# EAGLE design misko_nucleo (EAGLE 9.6.2)
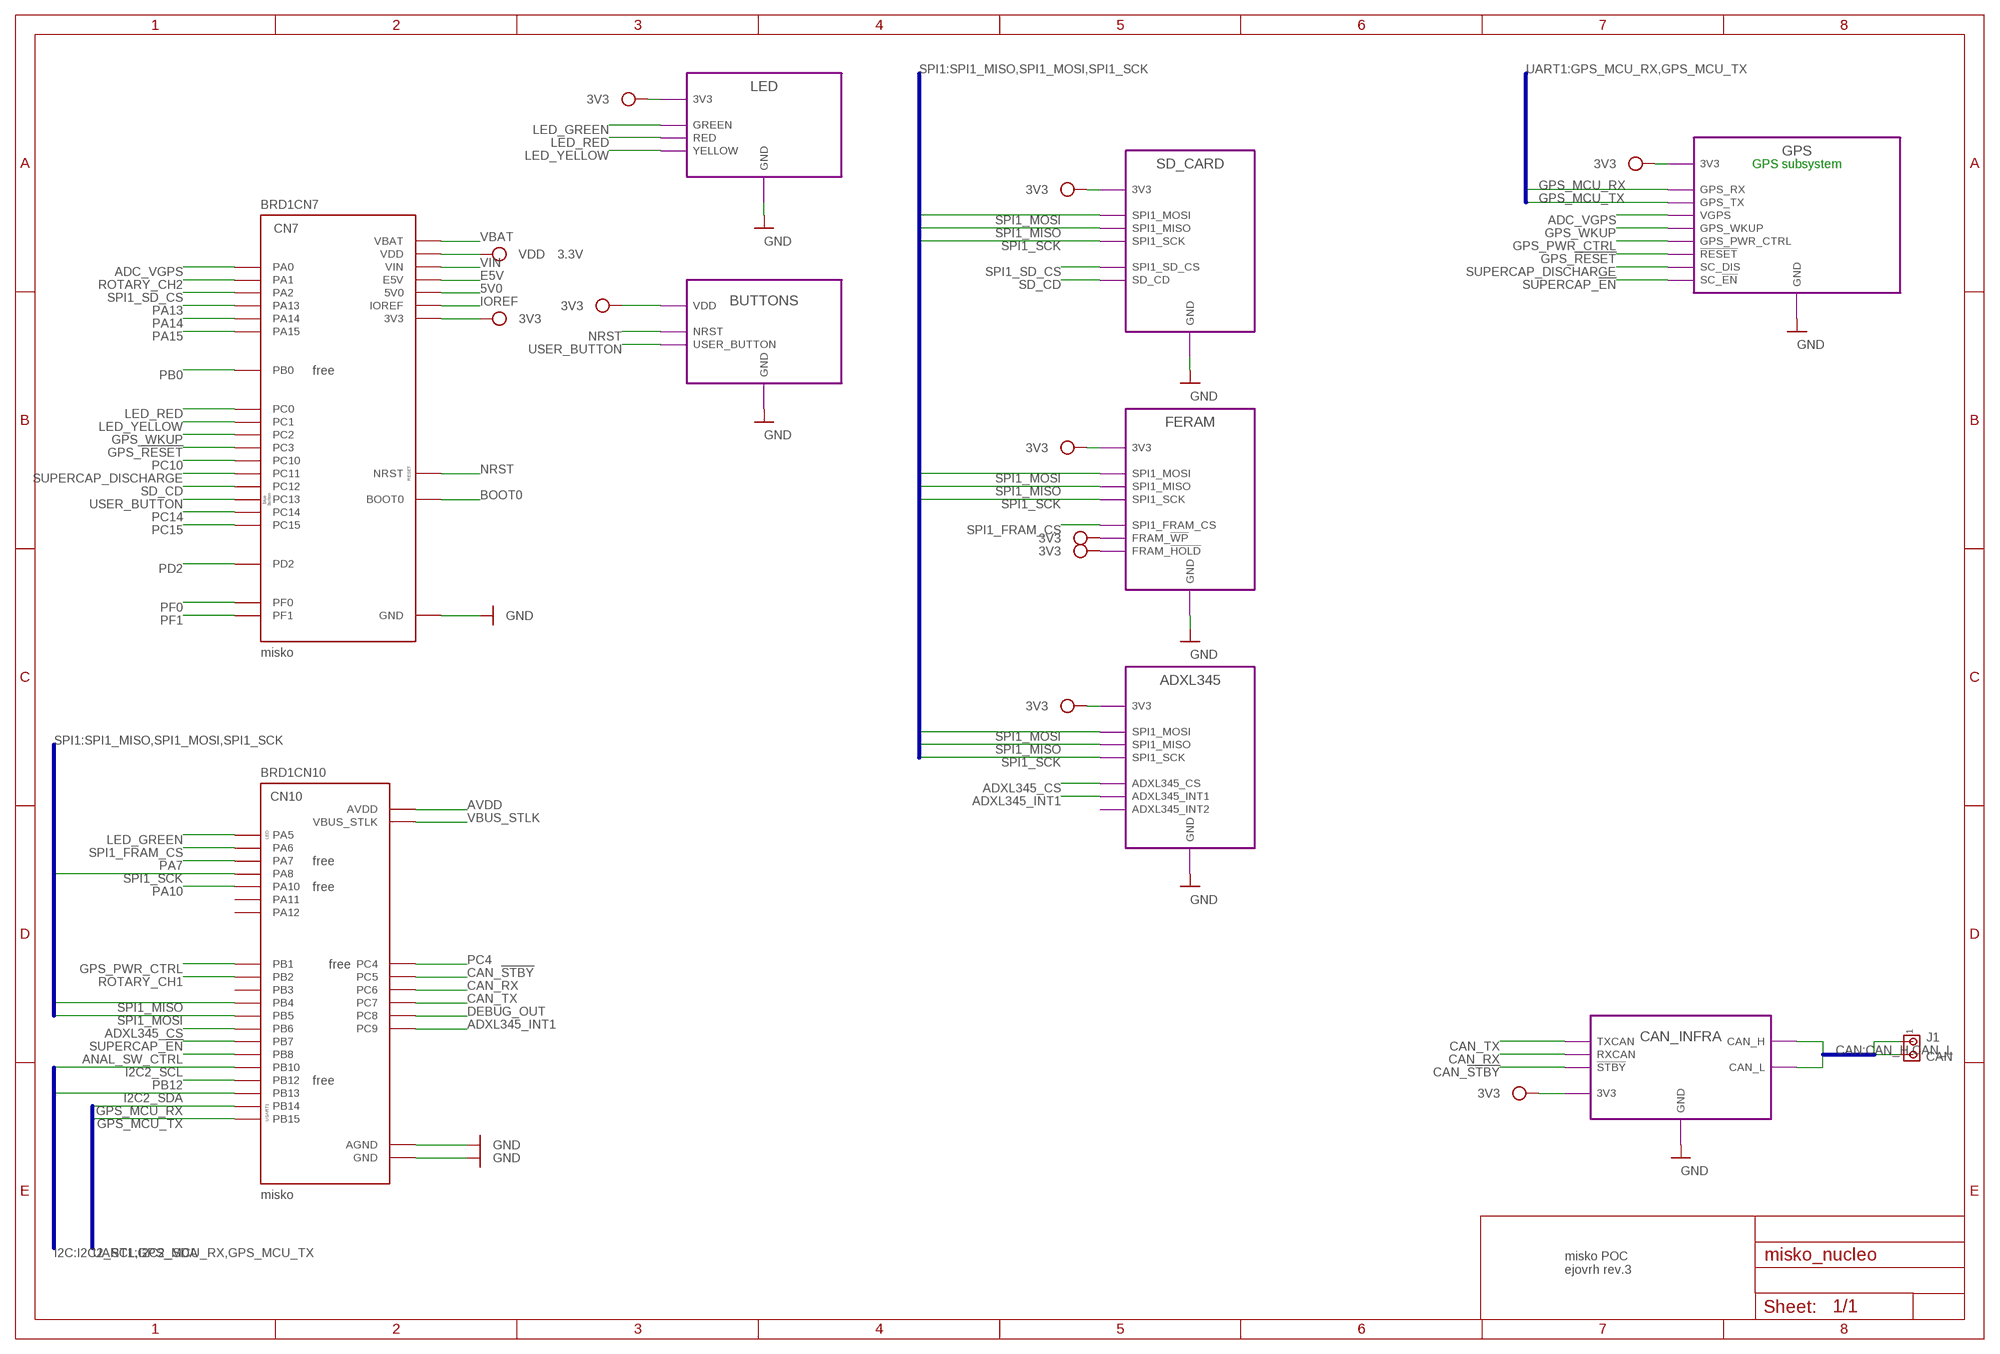
[diagram p0: schematic, sheet 1]

## Parts
BRD1  misko  NUCLEO-H503RB-B02  [NUCLEO-H503RB-B02]
J1  CAN  MTA02-100  [10X02MTA]

## Module instances
ADXL345 = ADXL345 (part numbers offset by 1300)
FERAM = FERAM (part numbers offset by 1200)
SD_CARD = SD_CARD (part numbers offset by 1100)
GPS = GPS_SUBSYSTEM (part numbers offset by 1500)
LED = LED (part numbers offset by 1700)
CAN_INFRA = CAN_INFRA (part numbers offset by 400)
BUTTONS = BUTTONS (part numbers offset by 1400)

## Nets
3V3 [3V3]: BRD1.CN7_16(CN7:3V3) ; port ADXL345.3V3 FERAM.3V3 FERAM.FRAM_!WP! FERAM.FRAM_!HOLD! SD_CARD.3V3 GPS.3V3 LED.3V3 CAN_INFRA.3V3 BUTTONS.VDD
5V0 [5V0]: BRD1.CN7_18(CN7:5V0)
ADC_VGPS [3V3]: BRD1.CN7_28(CN7:PA0) ; port GPS.VGPS
ADXL345_CS [signal]: BRD1.CN10_3(CN10:PB6) ; port ADXL345.ADXL345_CS
ADXL345_INT1 [signal]: BRD1.CN10_17(CN10:PC9) ; port ADXL345.ADXL345_INT1
ANAL_SW_CTRL [signal]: BRD1.CN10_36(CN10:PB8)
AVDD [signal]: BRD1.CN10_7(CN10:AVDD)
BOOT0 [signal]: BRD1.CN7_7(CN7:BOOT0)
CAN_!STBY! [signal]: BRD1.CN10_6(CN10:PC5) ; port CAN_INFRA.!STBY!
CAN_H [signal]: J1.1 ; port CAN_INFRA.CAN_H
CAN_L [signal]: J1.2 ; port CAN_INFRA.CAN_L
CAN_RX [signal]: BRD1.CN10_19(CN10:PC6) ; port CAN_INFRA.RXCAN
CAN_TX [signal]: BRD1.CN10_21(CN10:PC7) ; port CAN_INFRA.TXCAN
DEBUG_OUT [signal]: BRD1.CN10_2(CN10:PC8)
E5V [5V0]: BRD1.CN7_6(CN7:E5V)
GND: BRD1.CN7_8(CN7:GND) BRD1.CN7_19(CN7:GND) BRD1.CN7_20(CN7:GND) BRD1.CN7_22(CN7:GND) BRD1.CN10_9(CN10:GND) BRD1.CN10_20(CN10:GND) BRD1.CN10_32(CN10:AGND) ; port ADXL345.GND FERAM.GND SD_CARD.GND GPS.GND LED.GND CAN_INFRA.GND BUTTONS.GND
GPS_!RESET! [signal]: BRD1.CN7_37(CN7:PC3) ; port GPS.!RESET!
GPS_MCU_RX [signal]: BRD1.CN10_28(CN10:PB14) BRD1.CN10_35(CN10:PB14) ; port GPS.GPS_RX
GPS_MCU_TX [signal]: BRD1.CN10_26(CN10:PB15) BRD1.CN10_37(CN10:PB15) ; port GPS.GPS_TX
GPS_PWR_CTRL [signal]: BRD1.CN10_24(CN10:PB1) ; port GPS.GPS_PWR_CTRL
GPS_WKUP [signal]: BRD1.CN7_35(CN7:PC2) ; port GPS.GPS_WKUP
I2C2_SCL [signal]: BRD1.CN10_25(CN10:PB10)
I2C2_SDA [signal]: BRD1.CN10_30(CN10:PB13)
IOREF [signal]: BRD1.CN7_12(CN7:IOREF)
LED_GREEN [signal]: BRD1.CN10_11(CN10:PA5) ; port LED.GREEN
LED_RED [signal]: BRD1.CN7_38(CN7:PC0) ; port LED.RED
LED_YELLOW [signal]: BRD1.CN7_36(CN7:PC1) ; port LED.YELLOW
NRST [signal]: BRD1.CN7_14(CN7:NRST) ; port BUTTONS.NRST
PA7 [signal]: BRD1.CN10_15(CN10:PA7)
PA10 [signal]: BRD1.CN10_33(CN10:PA10)
PA13 [signal]: BRD1.CN7_13(CN7:PA13)
PA14 [signal]: BRD1.CN7_15(CN7:PA14)
PA15 [signal]: BRD1.CN7_17(CN7:PA15)
PB0 [signal]: BRD1.CN7_34(CN7:PB0)
PB12 [signal]: BRD1.CN10_16(CN10:PB12)
PC4 [signal]: BRD1.CN10_34(CN10:PC4)
PC10 [signal]: BRD1.CN7_1(CN7:PC10)
PC14 [signal]: BRD1.CN7_25(CN7:PC14)
PC15 [signal]: BRD1.CN7_27(CN7:PC15)
PD2 [signal]: BRD1.CN7_4(CN7:PD2)
PF0 [signal]: BRD1.CN7_29(CN7:PF0)
PF1 [signal]: BRD1.CN7_31(CN7:PF1)
ROTARY_CH1 [signal]: BRD1.CN10_22(CN10:PB2)
ROTARY_CH2 [signal]: BRD1.CN7_30(CN7:PA1)
SD_CD [signal]: BRD1.CN7_3(CN7:PC12) ; port SD_CARD.SD_CD
SPI1_FRAM_CS [signal]: BRD1.CN10_13(CN10:PA6) ; port FERAM.SPI1_FRAM_CS
SPI1_MISO [signal]: BRD1.CN10_27(CN10:PB4) ; port ADXL345.SPI1_MISO FERAM.SPI1_MISO SD_CARD.SPI1_MISO
SPI1_MOSI [signal]: BRD1.CN10_29(CN10:PB5) ; port ADXL345.SPI1_MOSI FERAM.SPI1_MOSI SD_CARD.SPI1_MOSI
SPI1_SCK [signal]: BRD1.CN10_23(CN10:PA8) ; port ADXL345.SPI1_SCK FERAM.SPI1_SCK SD_CARD.SPI1_SCK
SPI1_SD_CS [signal]: BRD1.CN7_32(CN7:PA2) ; port SD_CARD.SPI1_SD_CS
SUPERCAP_!EN! [signal]: BRD1.CN10_5(CN10:PB7) ; port GPS.SC_!EN!
SUPERCAP_DISCHARGE [signal]: BRD1.CN7_2(CN7:PC11) ; port GPS.SC_DIS
USER_BUTTON [signal]: BRD1.CN7_23(CN7:PC13) ; port BUTTONS.USER_BUTTON
VBAT [signal]: BRD1.CN7_33(CN7:VBAT)
VBUS_STLK [signal]: BRD1.CN10_8(CN10:VBUS_STLK)
VDD [3V3]: BRD1.CN7_5(CN7:VDD)
VIN [5V0]: BRD1.CN7_24(CN7:VIN)
Unconnected: BRD1.CN10_12(CN10:PA12) BRD1.CN10_14(CN10:PA11) BRD1.CN10_31(CN10:PB3)

## Buses
SPI1:SPI1_MISO,SPI1_MOSI,SPI1_SCK
UART1:GPS_MCU_RX,GPS_MCU_TX
I2C:I2C2_SCL,I2C2_SDA
CAN:CAN_H,CAN_L

## Notes on the sheet
- GPS subsystem
- 3.3V
- free
- free
- free
- free
- free
- misko POC
  ejovrh rev.3

## Library data of the parts
BRD1 = NUCLEO-H503RB-B02:NUCLEO-H503RB-B02: Check availability <https://pricing.snapeda.com/parts/NUCLEO-F303RE/STMicroelectronics/view-part?ref=eda>; AVAILABILITY: In Stock; CHECK_PRICES: https://www.snapeda.com/parts/NUCLEO-F303RE/STMicroelectronics/view-part/?ref=eda; DESCRIPTION: STM32F303RE, mbed-Enabled Development Nucleo-64 STM32F3 ARM® Cortex®-M4 MCU 32-Bit Embedded Evaluation Board; MF: STMicroelectronics; MP: NUCLEO-F303RE; PACKAGE: None; PRICE: None; PURCHASE-URL: https://www.snapeda.com/api/url_track_click_mouser/?unipart_id=246753&manufacturer=STMicroelectronics&part_name=NUCLEO-F303RE&search_term=nucleo-h; SNAPEDA_LINK: https://www.snapeda.com/parts/NUCLEO-F303RE/STMicroelectronics/view-part/?ref=snap
J1 = con-amp:MTA02-100: AMP connector

## Module ADXL345
Ports: GND(pwr) 3V3(pwr) ADXL345_INT1(out) ADXL345_CS(in) SPI1_MOSI(in) SPI1_MISO(out) SPI1_SCK(in) ADXL345_INT2(out)
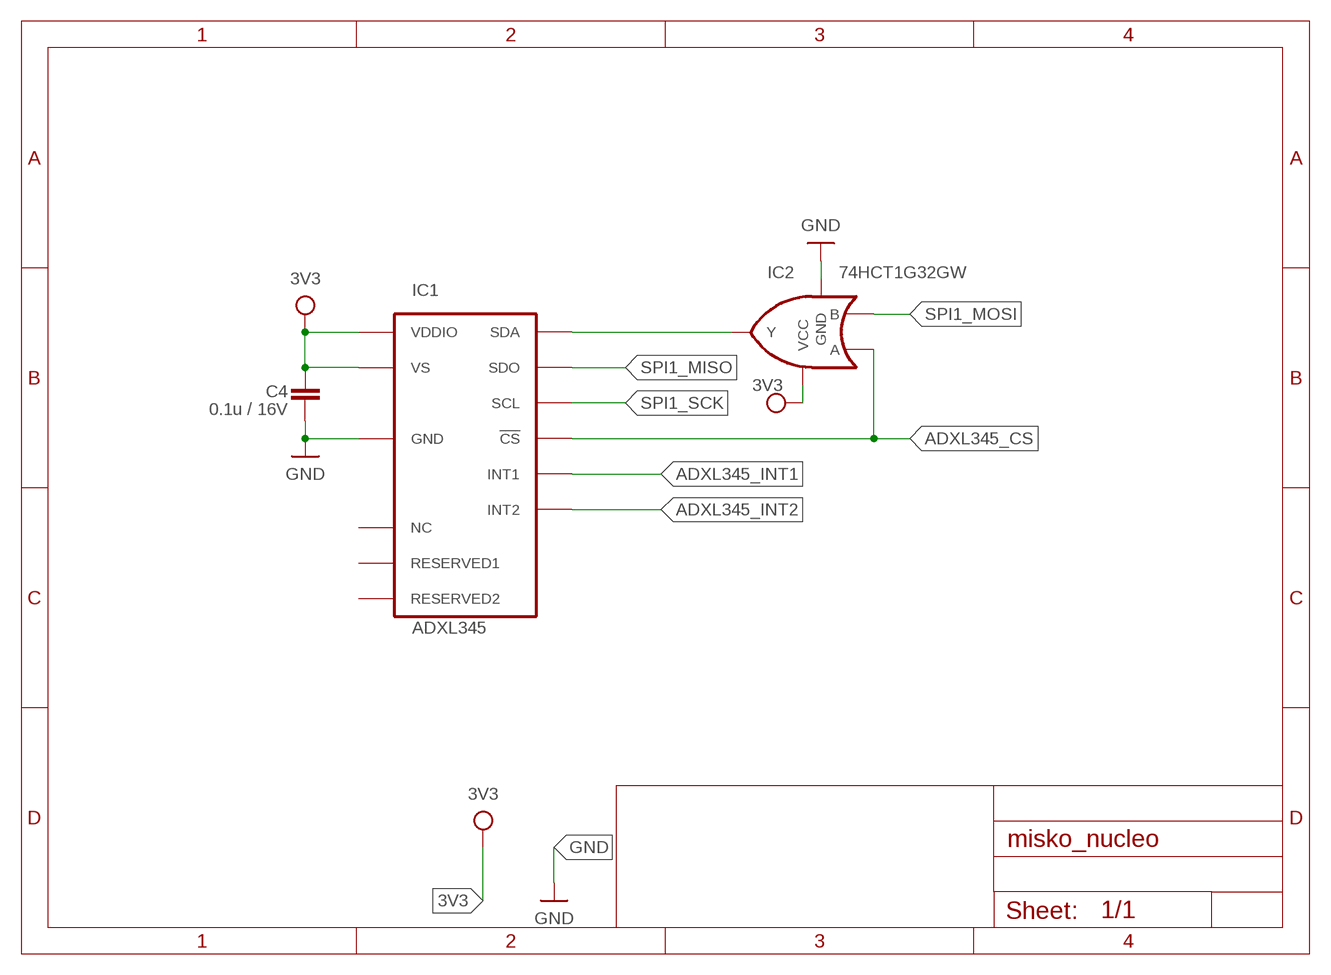
[diagram p1: schematic, module ADXL345, sheet 1]

### Parts
C4  0.1u / 16V  C-EUC0402  [C0402]
IC1  ADXL345  [LGA14]
IC2  74HCT1G32GW  74HCT1G32GW-DC  [SOT353/5]

### Nets
3V3: C4.1 IC1.VCC(VS) IC1.VDD(VDDIO) IC2.VCC
ADXL345_CS [signal]: IC1.!CS! IC2.A
ADXL345_INT1 [signal]: IC1.INT1
ADXL345_INT2: IC1.INT2
ADXL345SDA [signal]: IC1.SDA IC2.Y
GND: C4.2 IC1.GND1(GND) IC1.GND2(GND) IC1.GND3(GND) IC2.GND
SPI1_MISO [signal]: IC1.SDO
SPI1_MOSI [signal]: IC2.B
SPI1_SCK [signal]: IC1.SCL
Unconnected: IC1.NC IC1.RESERVED1 IC1.RESERVED2

### Library data of the parts
C4 = rcl:C-EU: CAPACITOR, European symbol
IC1 = ADXL345 Accelerometer:ADXL345: 3-Axis, ±2 g/±4 g/±8 g/±16 g Digital Accelerometer
IC2 = 74HCT1G32GW - OR Gate:74HCT1G32GW: Two Input OR gate

## Module FERAM
Ports: GND(pwr) 3V3(pwr) SPI1_MOSI(in) SPI1_MISO(out) SPI1_SCK(in) SPI1_FRAM_CS(in) FRAM_!WP!(in) FRAM_!HOLD!(in)
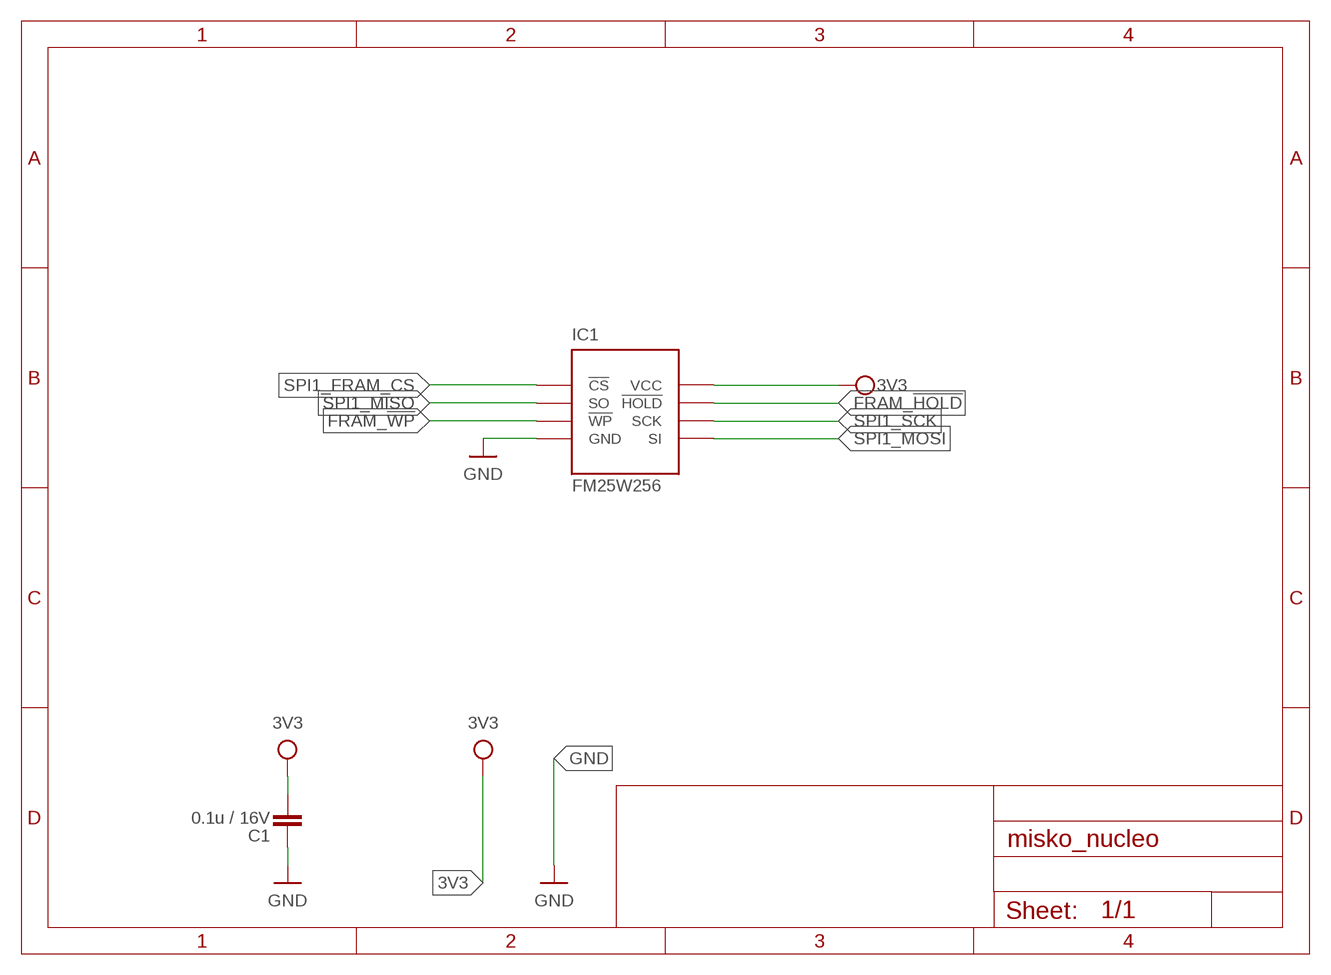
[diagram p2: schematic, module FERAM, sheet 1]

### Parts
C1  0.1u / 16V  C-EUC0402  [C0402]
IC1  FM25W256  FM25W256-SOIC  [SOIC08]

### Nets
3V3: C1.1 IC1.VCC
FRAM_!HOLD!: IC1.!HOLD!
FRAM_!WP!: IC1.!WP!
GND: C1.2 IC1.GND
SPI1_FRAM_CS [signal]: IC1.!CS!
SPI1_MISO [signal]: IC1.SO
SPI1_MOSI [signal]: IC1.SI
SPI1_SCK [signal]: IC1.SCK

### Library data of the parts
C1 = rcl:C-EU: CAPACITOR, European symbol
IC1 = FM25W256 FERAM:FM25W256: FeRAM Module; OC_FARNELL: unknown; OC_NEWARK: unknown

## Module SD_CARD
Ports: GND(pwr) 3V3(pwr) SPI1_MOSI(in) SPI1_MISO(out) SPI1_SCK(in) SPI1_SD_CS(in) SD_CD(hiz)
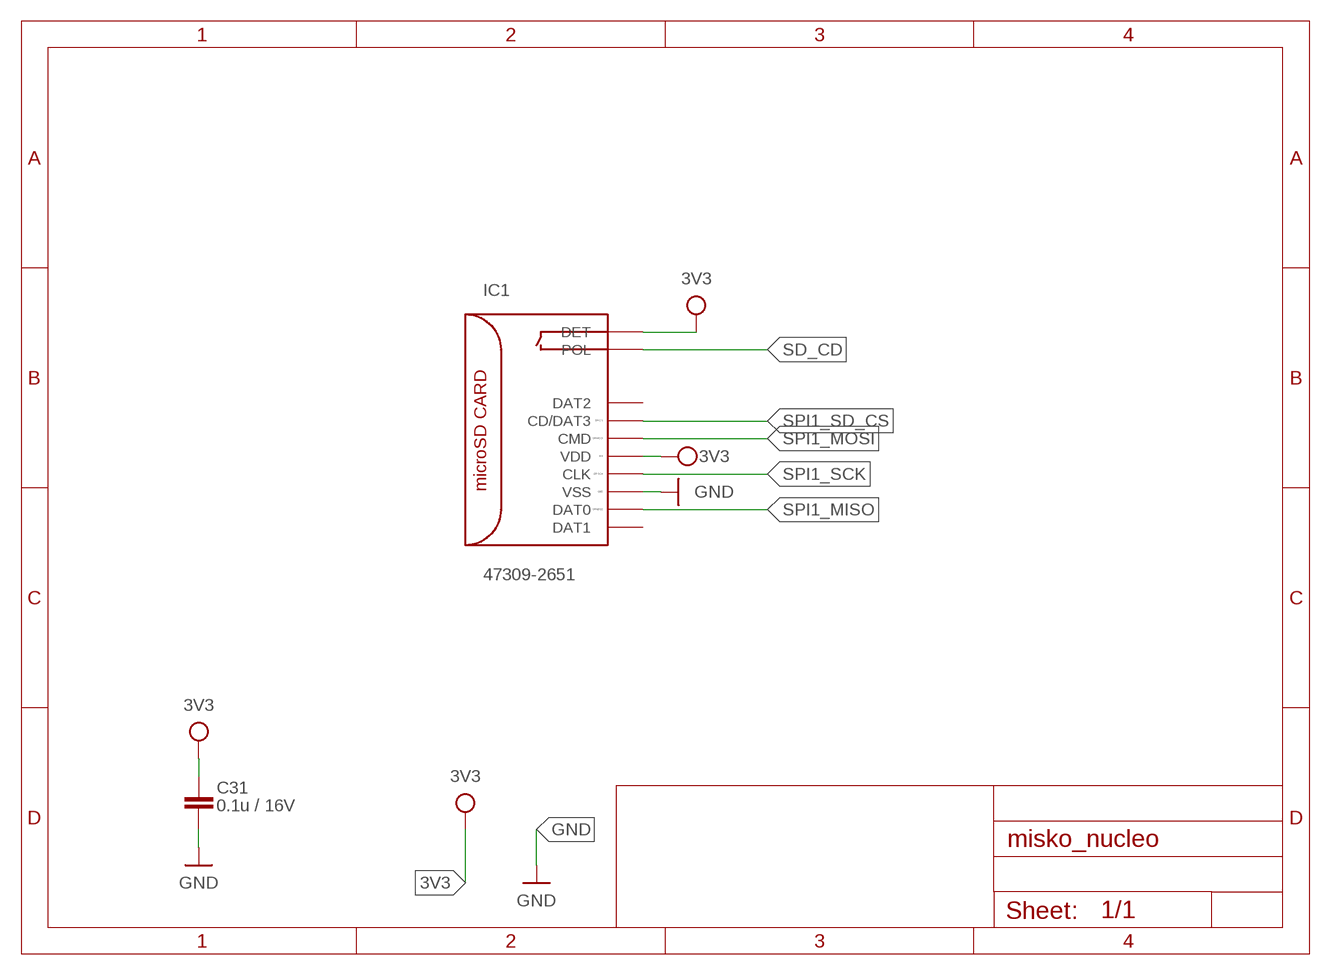
[diagram p3: schematic, module SD_CARD, sheet 1]

### Parts
C31  0.1u / 16V  C-EUC0402  [C0402]
IC1  47309-2651  MICROSD_SPI_MODE  [MICRO_SD_CONNECTOR]

### Nets
3V3: C31.1 IC1.DET IC1.VDD
GND: C31.2 IC1.GND1(VSS) IC1.GND2(VSS) IC1.GND3(VSS)
SD_CD: IC1.POL
SPI1_MISO: IC1.DAT0
SPI1_MOSI: IC1.CMD
SPI1_SCK: IC1.CLK
SPI1_SD_CS: IC1.CD/DAT3
Unconnected: IC1.DAT1 IC1.DAT2

### Library data of the parts
C31 = rcl:C-EU: CAPACITOR, European symbol
IC1 = Molex SD-47309 SD Card Slot:MICROSD_SPI_MODE: MOLEX - 49225-0821 - CONNECTEUR MICRO SD PUSH/PUSH REV Fabricant: MOLEX Code commande Farnell: 1366700 <http://fr.farnell.com/molex/49225-0821/connecteur-micro-sd-push-push-rev/dp/1366700?Ntt=1366700> Référence fabricant: 49225-0821

## Module ORG1510
Ports: GND(pwr) VGPS(pwr) RX(in) TX(out) WAKEUP(out) FORCE-ON(in) !RESET!(in)
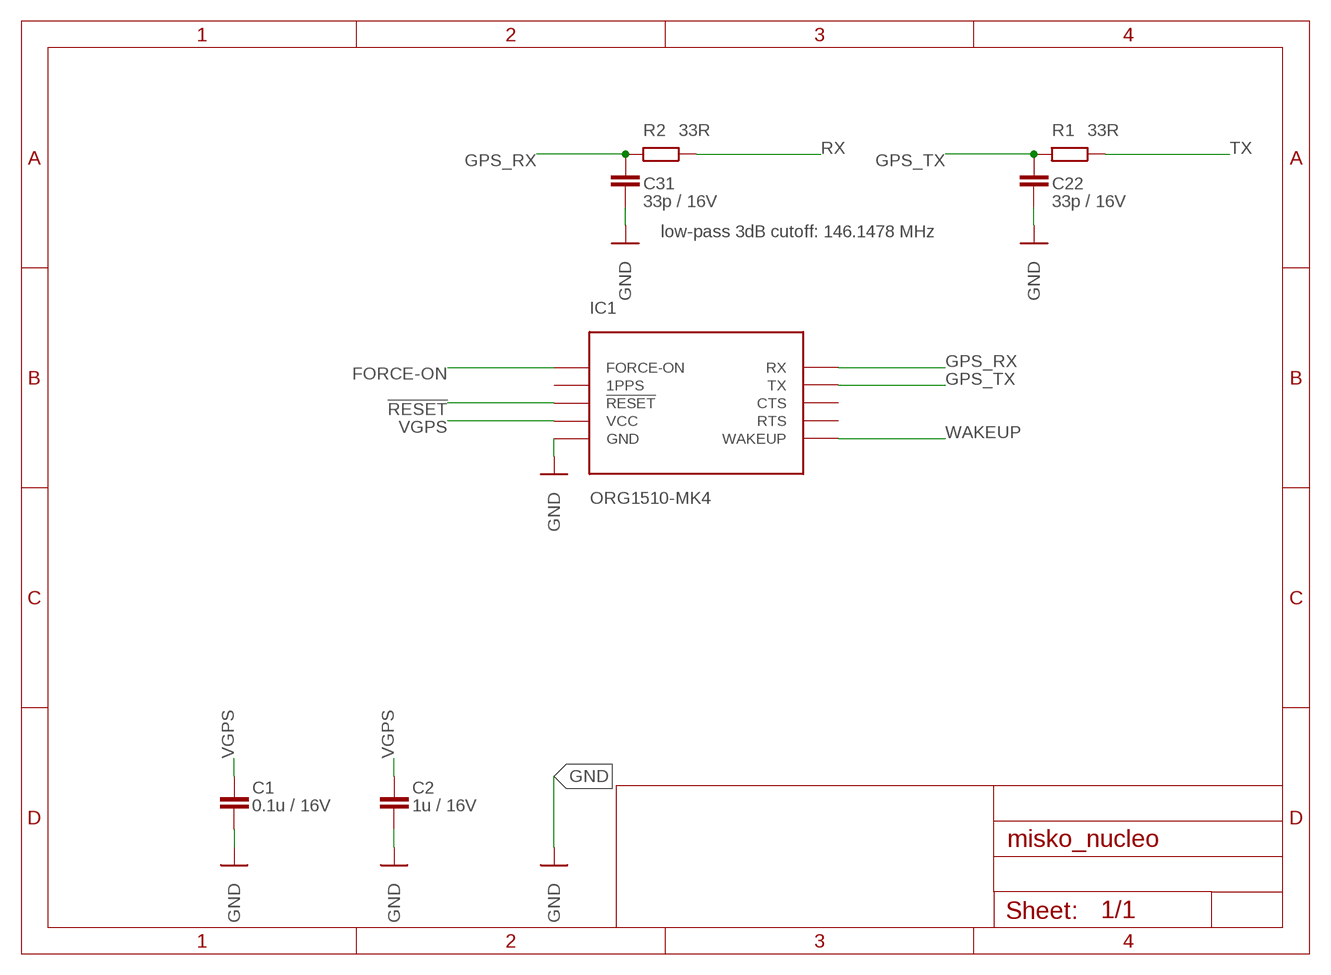
[diagram p4: schematic, module ORG1510, sheet 1]

### Parts
C1  0.1u / 16V  C-EUC0402  [C0402]
C2  1u / 16V  C-EUC0402  [C0402]
C22  33p / 16V  C-EUC0402  [C0402]
C31  33p / 16V  C-EUC0402  [C0402]
IC1  ORG1510-MK4  [SMD]
R1  33R  R-EU_R0402  [R0402]
R2  33R  R-EU_R0402  [R0402]

### Nets
!RESET! [signal]: IC1.!RESET!_8(!RESET!)
FORCE-ON [signal]: IC1.1_ON_OFF(FORCE-ON)
GND: C1.2 C2.2 C22.2 C31.2 IC1.5_GND(GND) IC1.GND1(GND) IC1.GND2(GND) IC1.GND4(GND) IC1.GND5(GND) IC1.GND6(GND) IC1.GND7(GND) IC1.GND8(GND) IC1.GND9(GND) IC1.GND10(GND) IC1.GND12(GND) IC1.GND13(GND) IC1.GND14(GND) IC1.GND15(GND)
GPS_RX [signal]: C31.1 IC1.RX_10(RX) R2.2
GPS_TX [signal]: C22.1 IC1.3_TX(TX) R1.2
RX [signal]: R2.1
TX [signal]: R1.1
VGPS [3V3]: C1.1 C2.1 IC1.4_VCC(VCC)
WAKEUP [signal]: IC1.WAKEUP_6(WAKEUP)
Unconnected: IC1.2_1PPS(1PPS) IC1.CTS_7(RTS) IC1.RTS_9(CTS)

### Notes on the sheet
- low-pass 3dB cutoff: 146.1478 MHz

### Library data of the parts
C1 C2 = resistor:C-EU: CAPACITOR, European symbol
C22 C31 = rcl:C-EU: CAPACITOR, European symbol
IC1 = ORG1510-MK4 GPS module:ORG1510-MK4
R1 R2 = rcl:R-EU_: RESISTOR, European symbol; SPICEPREFIX: R

## Module VOLTAGE_SUPERVISOR
Ports: GND(pwr) 3V3(pwr) !RESET!(out) !MR!(in) SENSE(hiz)
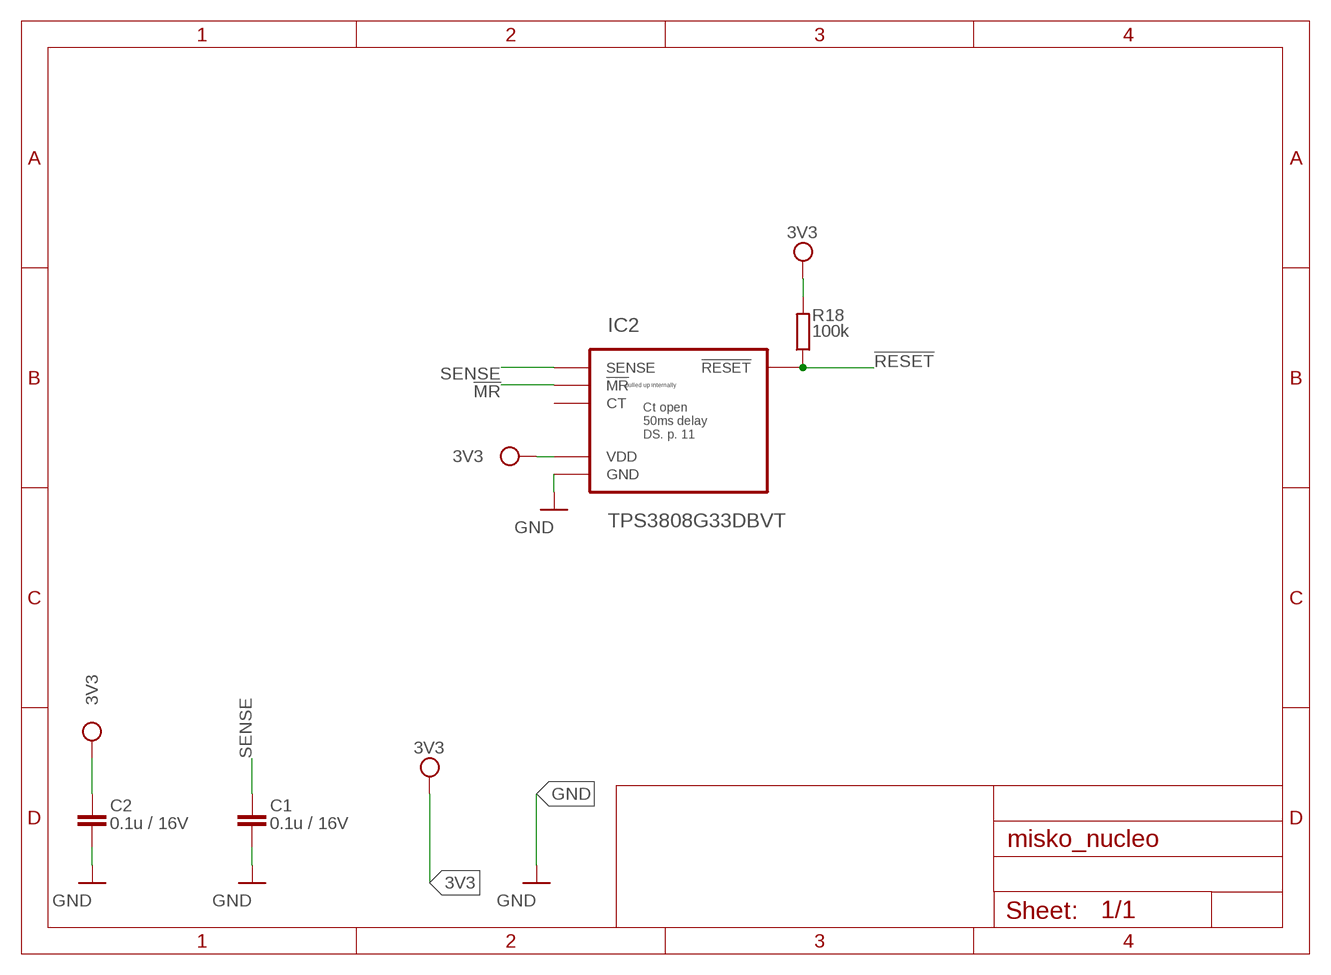
[diagram p5: schematic, module VOLTAGE_SUPERVISOR, sheet 1]

### Parts
C1  0.1u / 16V  C-EUC0402  [C0402]
C2  0.1u / 16V  C-EUC0402  [C0402]
IC2  TPS3808G33DBVT  TPS3808WSON6  [WSON-6]
R18  100k  R-EU_R0402  [R0402]

### Nets
3V3 [3V3]: C2.1 IC2.VDD R18.2
!MR! [signal]: IC2.!MR!
!RESET! [signal]: IC2.!RESET! R18.1
GND: C1.2 C2.2 IC2.GND1(GND) IC2.GND2(GND)
SENSE [3V3]: C1.1 IC2.SENSE
Unconnected: IC2.CT

### Notes on the sheet
- Ct open
  50ms delay
  DS. p. 11

### Library data of the parts
C1 C2 = rcl:C-EU: CAPACITOR, European symbol
IC2 = TPS3808 - Supervisory Circuit:TPS3808: Low Quiescent Current, Programmable-Delay Supervisory Circuit
R18 = resistor:R-EU_: RESISTOR, European symbol

## Module SUPERCAP+CHARGER
Ports: GND(pwr) 3V3(pwr) VOUT(pwr) !EN!(in) SC_DIS(in)
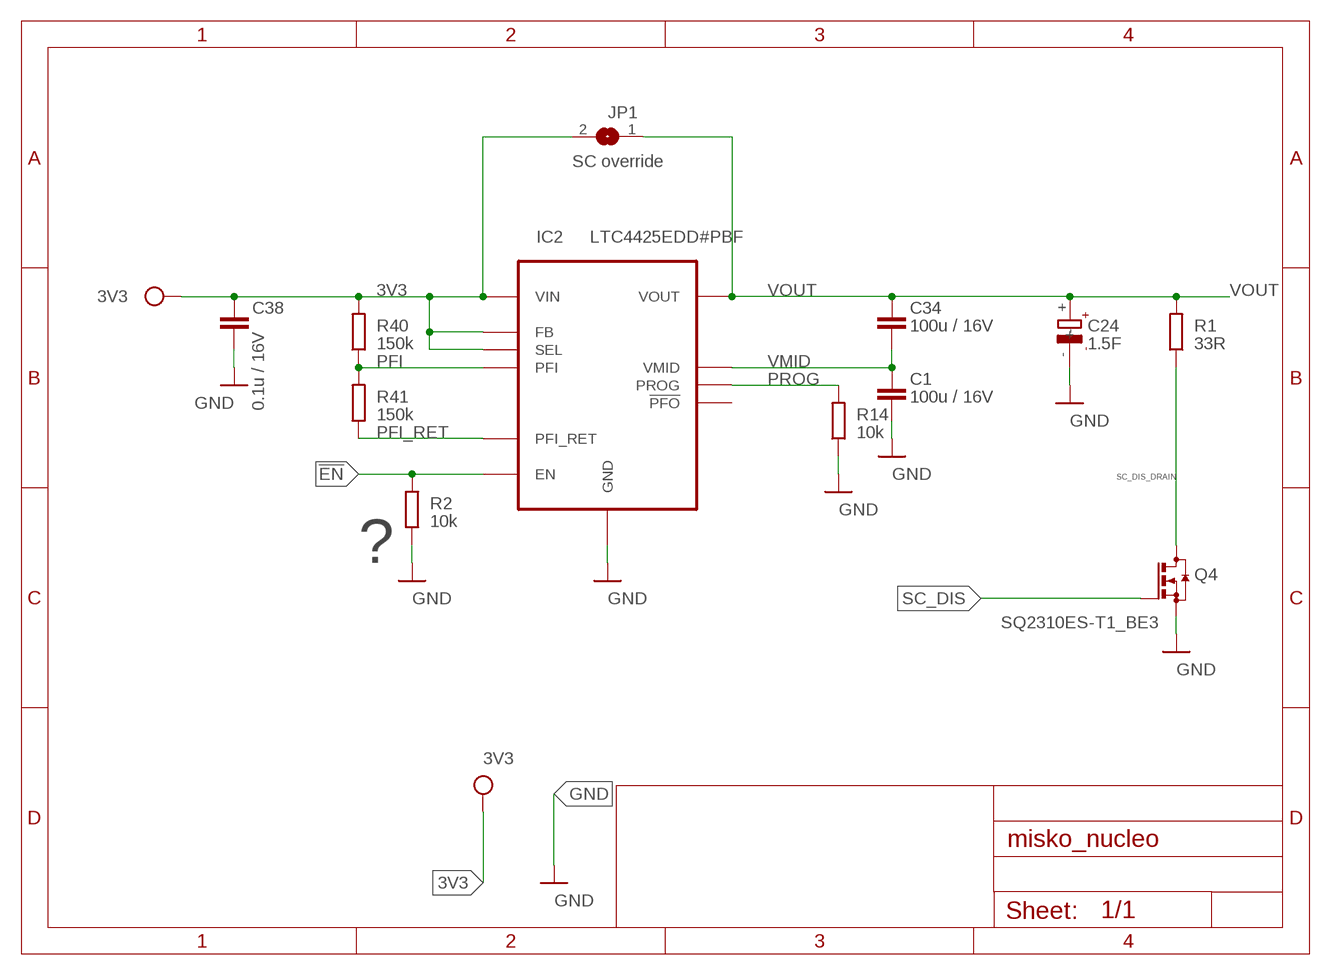
[diagram p6: schematic, module SUPERCAP+CHARGER, sheet 1]

### Parts
C1  100u / 16V  C-EUC1210  [C1210]
C24  1.5F  EECS5R5H155  [TH]
C34  100u / 16V  C-EUC1210  [C1210]
C38  0.1u / 16V  C-EUC0402  [C0402]
IC2  LTC4425EDD#PBF  LTC4425DFN-12  [DFN-12]
JP1  SC override  SJW  [SJW]
Q4  SQ2310ES-T1_BE3  BSS123  [SOT23]
R1  33R  R-EU_R1206  [R1206]
R2  10k  R-EU_R0402  [R0402]
R14  10k  R-EU_R0402  [R0402]
R40  150k  R-EU_R0402  [R0402]
R41  150k  R-EU_R0402  [R0402]

### Nets
3V3 [3V3]: C38.1 IC2.FB IC2.SEL IC2.VIN1(VIN) IC2.VIN2(VIN) JP1.2 R40.2
!EN! [signal]: IC2.EN R2.2
GND: C1.2 C24.- C38.2 IC2.GND Q4.2(S) R2.1 R14.1
PFI [signal]: IC2.PFI R40.1 R41.2
PFI_RET [signal]: IC2.PFI_RET R41.1
PROG [signal]: IC2.PROG R14.2
SC_DIS [signal]: Q4.1(G)
SC_DIS_DRAIN [signal]: Q4.3(D) R1.1
VMID [signal]: C1.1 C34.2 IC2.VMID
VOUT [3V3]: C24.+ C34.1 IC2.VOUT1(VOUT) IC2.VOUT2(VOUT) JP1.1 R1.2
Unconnected: IC2.!PFO!

### Notes on the sheet
- ?

### Library data of the parts
C1 C34 C38 = rcl:C-EU: CAPACITOR, European symbol
C24 = EECS5R5H155 Supercap:EECS5R5H155
IC2 = LTC4425 Supercap Charger:LTC4425: The ISL85003 and ISL85003A are synchronous buck regulators with integrated high-side and low-side FET’s. The regulator can operate from an input voltage range of 4.5V to 18V while delivering a very efficient continuous 3A current. This is all delivered in a very compact 3x4mm DFN package. More about it you can find at ISL85003 <http://www.intersil.com/en/products/power-management/switching-regulators/integrated-fet-regulators/ISL85003.html> The library has been designed by Richard Magdycz <https://www.facebook.com/groups/eaglecadsoftUK>
JP1 = jumper:SJ: SMD solder JUMPER
Q4 = transistor-small-signal:BSS123: N-CHANNEL MOS FET
R1 R2 R14 R40 R41 = resistor:R-EU_: RESISTOR, European symbol

## Module GPS_SUBSYSTEM
Ports: GND(pwr) 3V3(pwr) GPS_TX(out) GPS_RX(in) GPS_WKUP(out) GPS_PWR_CTRL(in) !RESET!(in) SC_!EN!(in) SC_DIS(in) VGPS(pwr)
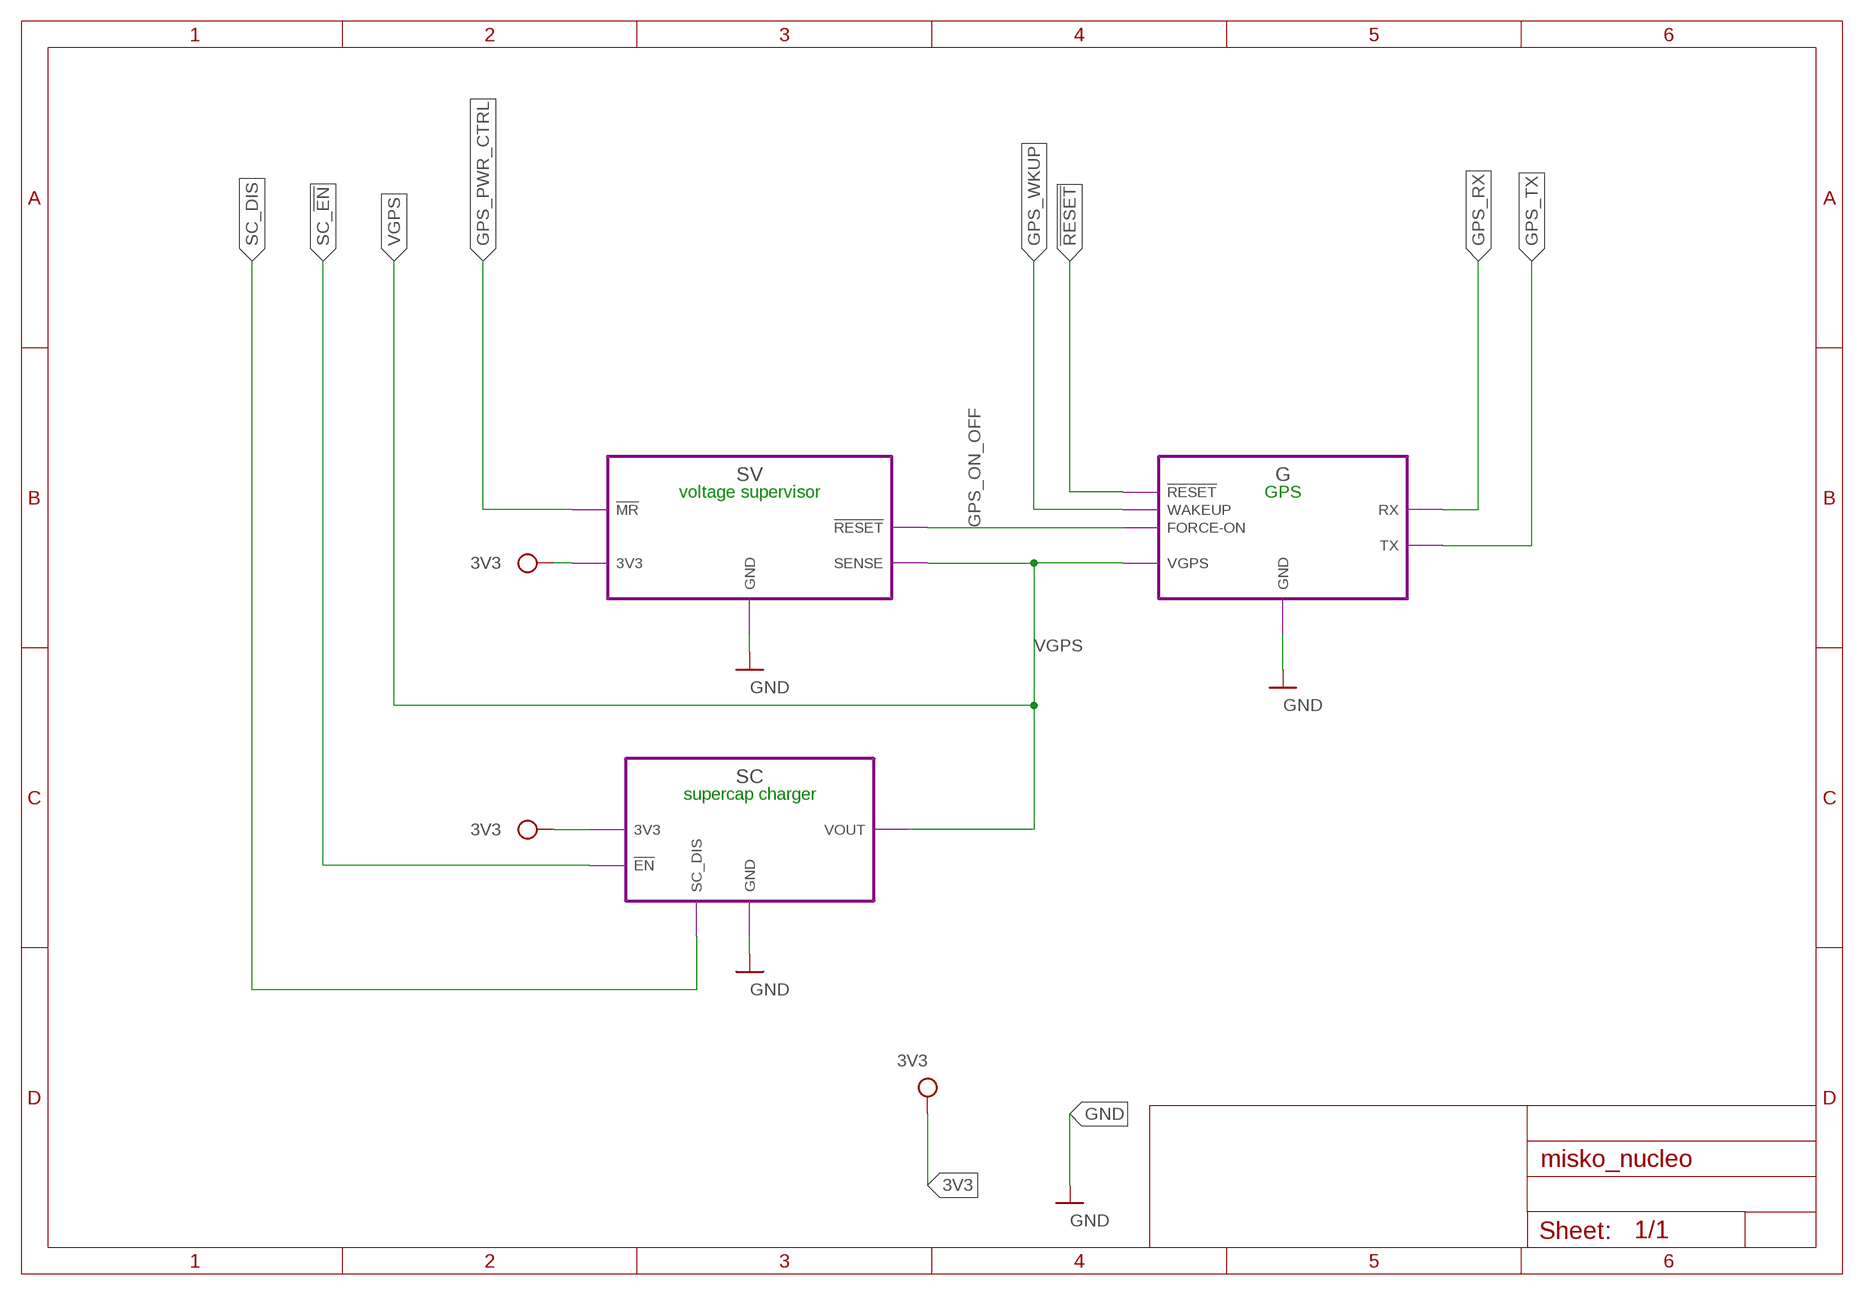
[diagram p7: schematic, module GPS_SUBSYSTEM, sheet 1]

### Module instances
G = ORG1510
SV = VOLTAGE_SUPERVISOR
SC = SUPERCAP+CHARGER

### Nets
3V3 [3V3]: port SC.3V3 SV.3V3
!RESET! [signal]: port G.!RESET!
GND: port SV.GND G.GND SC.GND
GPS_ON_OFF [signal]: port SV.!RESET! G.FORCE-ON
GPS_PWR_CTRL [signal]: port SV.!MR!
GPS_RX [signal]: port G.RX
GPS_TX [signal]: port G.TX
GPS_WKUP [signal]: port G.WAKEUP
SC_!EN! [signal]: port SC.!EN!
SC_DIS [signal]: port SC.SC_DIS
VGPS [3V3]: port G.VGPS SC.VOUT SV.SENSE

### Notes on the sheet
- voltage supervisor | GPS
- supercap charger

### Library data of the parts

## Module LED
Ports: 3V3(pwr) GND(pwr) GREEN(in) RED(in) YELLOW(in)
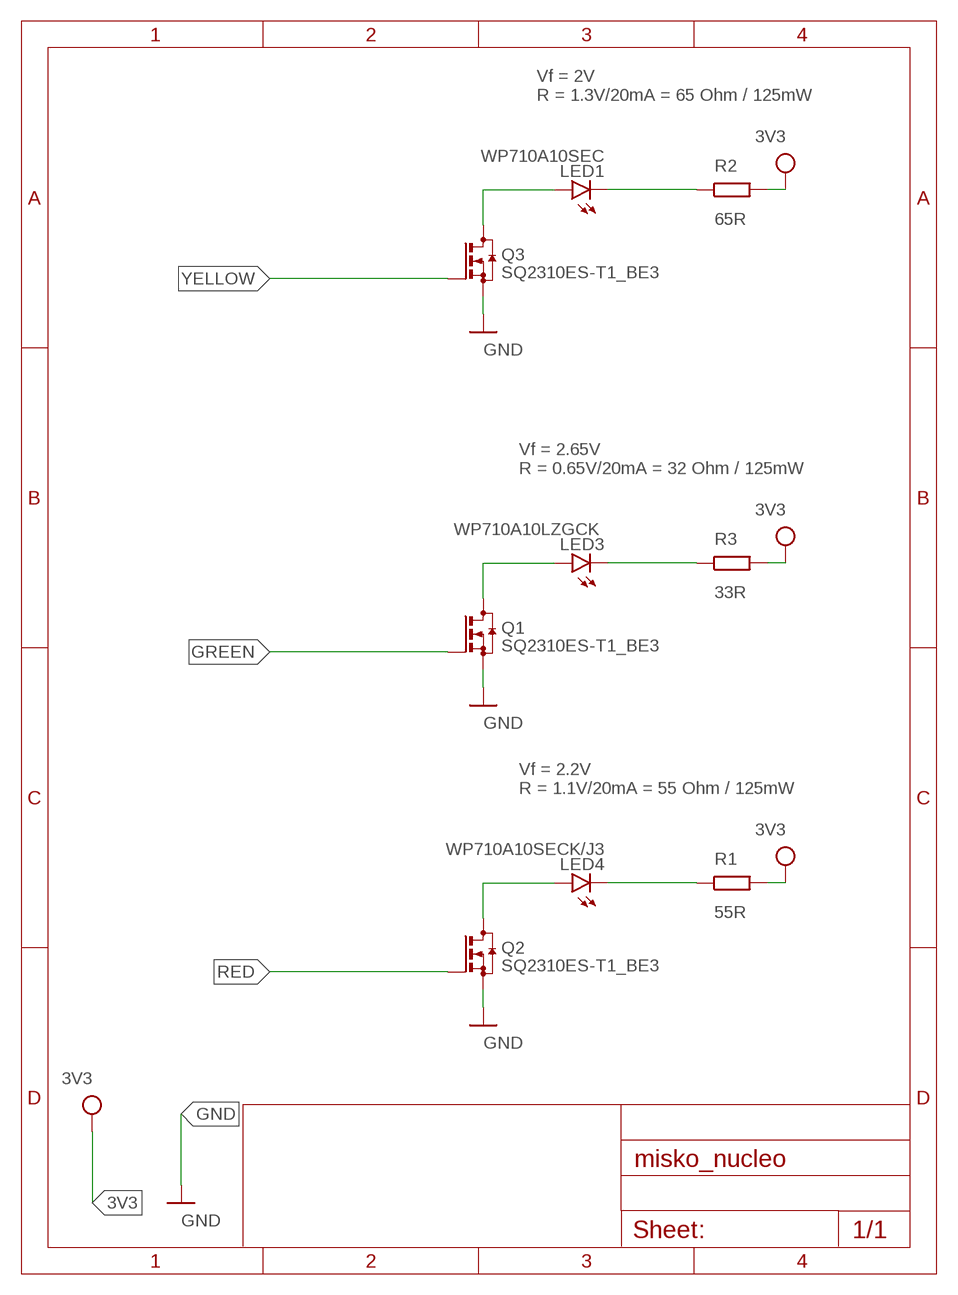
[diagram p8: schematic, module LED, sheet 1]

### Parts
LED1  WP710A10SEC  LEDSQR2X5  [LED2X5]
LED3  WP710A10LZGCK  LEDSQR2X5  [LED2X5]
LED4  WP710A10SECK/J3  LEDSQR2X5  [LED2X5]
Q1  SQ2310ES-T1_BE3  BSS123  [SOT23]
Q2  SQ2310ES-T1_BE3  BSS123  [SOT23]
Q3  SQ2310ES-T1_BE3  BSS123  [SOT23]
R1  55R  R-EU_R0402  [R0402]
R2  65R  R-EU_R0402  [R0402]
R3  33R  R-EU_R0402  [R0402]

### Nets
3V3 [3V3]: R1.2 R2.2 R3.2
G_A: LED3.A Q1.3(D)
G_C: LED3.K(C) R3.1
GND: Q1.2(S) Q2.2(S) Q3.2(S)
GREEN [signal]: Q1.1(G)
R_A: LED4.A Q2.3(D)
R_C [signal]: LED4.K(C) R1.1
RED [signal]: Q2.1(G)
Y_A: LED1.A Q3.3(D)
Y_C [signal]: LED1.K(C) R2.1
YELLOW [signal]: Q3.1(G)

### Notes on the sheet
- Vf = 2V
  R = 1.3V/20mA = 65 Ohm / 125mW
- Vf = 2.65V
  R = 0.65V/20mA = 32 Ohm / 125mW
- Vf = 2.2V
  R = 1.1V/20mA = 55 Ohm / 125mW

### Library data of the parts
LED1 LED3 LED4 = led:LED: LED OSRAM: - CHIPLED LG R971, LG N971, LY N971, LG Q971, LY Q971, LO R971, LY R971 LH N974, LH R974 LS Q976, LO Q976, LY Q976 LO Q996 - Hyper CHIPLED LW Q18S LB Q993, LB Q99A, LB R99A - SideLED LS A670, LO A670, LY A670, LG A670, LP A670 LB A673, LV A673, LT A673, LW A673 LH A674 LY A675 LS A676, LA A676, LO A676, LY A676, LW A676 LS A679, LY A679, LG A679 - Hyper Micro SIDELED® LS Y876, LA Y876, LO Y876, LY Y876 LT Y87S - SmartLED LW L88C, LW L88S LB L89C, LB L89S, LG L890 LS L89K, LO L89K, LY L89K LS L896, LA L896, LO L896, LY L896 - TOPLED LS T670, LO T670, LY T670, LG T670, LP T670 LSG T670, LSP T670, LSY T670, LOP T670, LYG T670 LG T671, LOG T671, LSG T671 LB T673, LV T673, LT T673, LW T673 LH T674 LS T676, LA T676, LO T676, LY T676, LB T676, LH T676, LSB T676, LW T676 LB T67C, LV T67C, LT T67C, LS T67K, LO T67K, LY T67K, LW E67C LS E67B, LA E67B, LO E67B, LY E67B, LB E67C, LV E67C, LT E67C LW T67C LS T679, LY T679, LG T679 LS T770, LO T770, LY T770, LG T770, LP T770 LB T773, LV T773, LT T773, LW T773 LH T774 LS E675, LA E675, LY E675, LS T675 LS T776, LA T776, LO T776, LY T776, LB T776 LHGB T686 LT T68C, LB T68C - Hyper Mini TOPLED® LB M676 - Mini TOPLED Santana® LG M470 LS M47K, LO M47K, LY M47K Source: http://www.osram.convergy.de LUXEON: - LUMILED® LXK2-PW12-R00, LXK2-PW12-S00, LXK2-PW14-U00, LXK2-PW14-V00 LXK2-PM12-R00, LXK2-PM12-S00, LXK2-PM14-U00 LXK2-PE12-Q00, LXK2-PE12-R00, LXK2-PE12-S00, LXK2-PE14-T00, LXK2-PE14-U00 LXK2-PB12-K00, LXK2-PB12-L00, LXK2-PB12-M00, LXK2-PB14-N00, LXK2-PB14-P00, LXK2-PB14-Q00 LXK2-PR12-L00, LXK2-PR12-M00, LXK2-PR14-Q00, LXK2-PR14-R00 LXK2-PD12-Q00, LXK2-PD12-R00, LXK2-PD12-S00 LXK2-PH12-R00, LXK2-PH12-S00 LXK2-PL12-P00, LXK2-PL12-Q00, LXK2-PL12-R00 Source: www.luxeon.com KINGBRIGHT: KA-3528ASYC Source: www.kingbright.com
Q1-Q3 = transistor-small-signal:BSS123: N-CHANNEL MOS FET
R1-R3 = rcl:R-EU_: RESISTOR, European symbol

## Module CAN_INFRA
Ports: CAN_H(io) CAN_L(io) GND(pwr) 3V3(pwr) TXCAN(in) RXCAN(out) !STBY!(in)
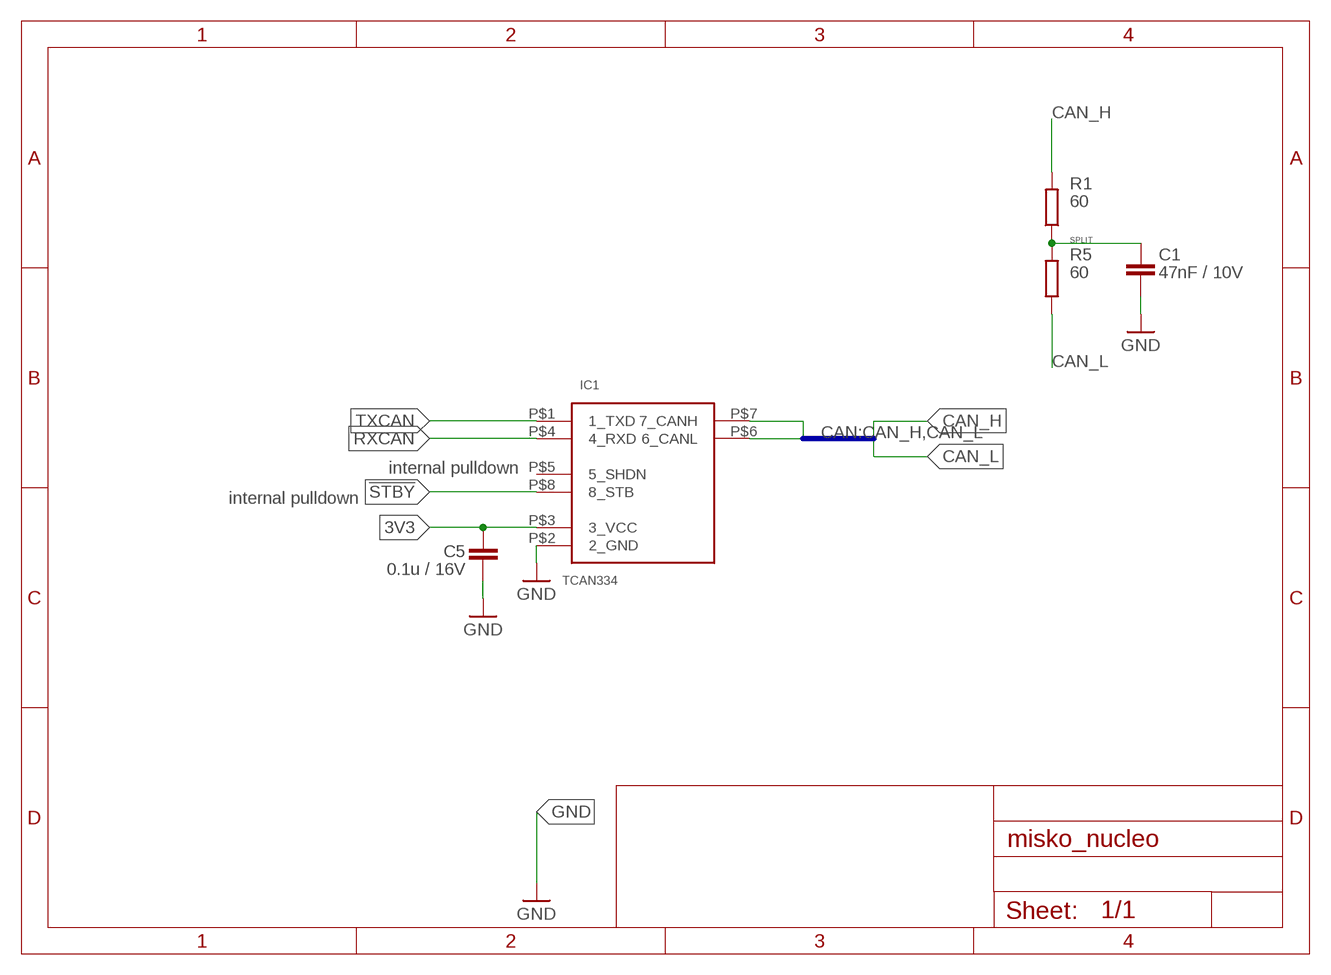
[diagram p9: schematic, module CAN_INFRA, sheet 1]

### Parts
C1  47nF / 10V  C-EUC0402  [C0402]
C5  0.1u / 16V  C-EUC0402  [C0402]
IC1  TCAN334  CAN33X  [SOT23-8]
R1  60  R-EU_R0805  [R0805]
R5  60  R-EU_R0805  [R0805]

### Nets
3V3 [3V3]: C5.1 IC1.P$3(3_VCC)
!STBY! [signal]: IC1.P$8(8_STB)
CAN_H [signal]: IC1.P$7(7_CANH) R1.2
CAN_L [signal]: IC1.P$6(6_CANL) R5.1
GND: C1.2 C5.2 IC1.P$2(2_GND)
RXCAN [signal]: IC1.P$4(4_RXD)
SPLIT [signal]: C1.1 R1.1 R5.2
TXCAN [signal]: IC1.P$1(1_TXD)
Unconnected: IC1.P$5(5_SHDN)

### Buses
CAN:CAN_H,CAN_L

### Notes on the sheet
- internal pulldown
- internal pulldown

### Library data of the parts
C1 C5 = rcl:C-EU: CAPACITOR, European symbol; SPICEPREFIX: C
IC1 = TCAN33x - 3.3V CAN Transciever:CAN33X
R1 R5 = rcl:R-EU_: RESISTOR, European symbol; SPICEPREFIX: R

## Module BUTTONS
Ports: GND(pwr) NRST(hiz) USER_BUTTON(hiz) VDD(pwr)
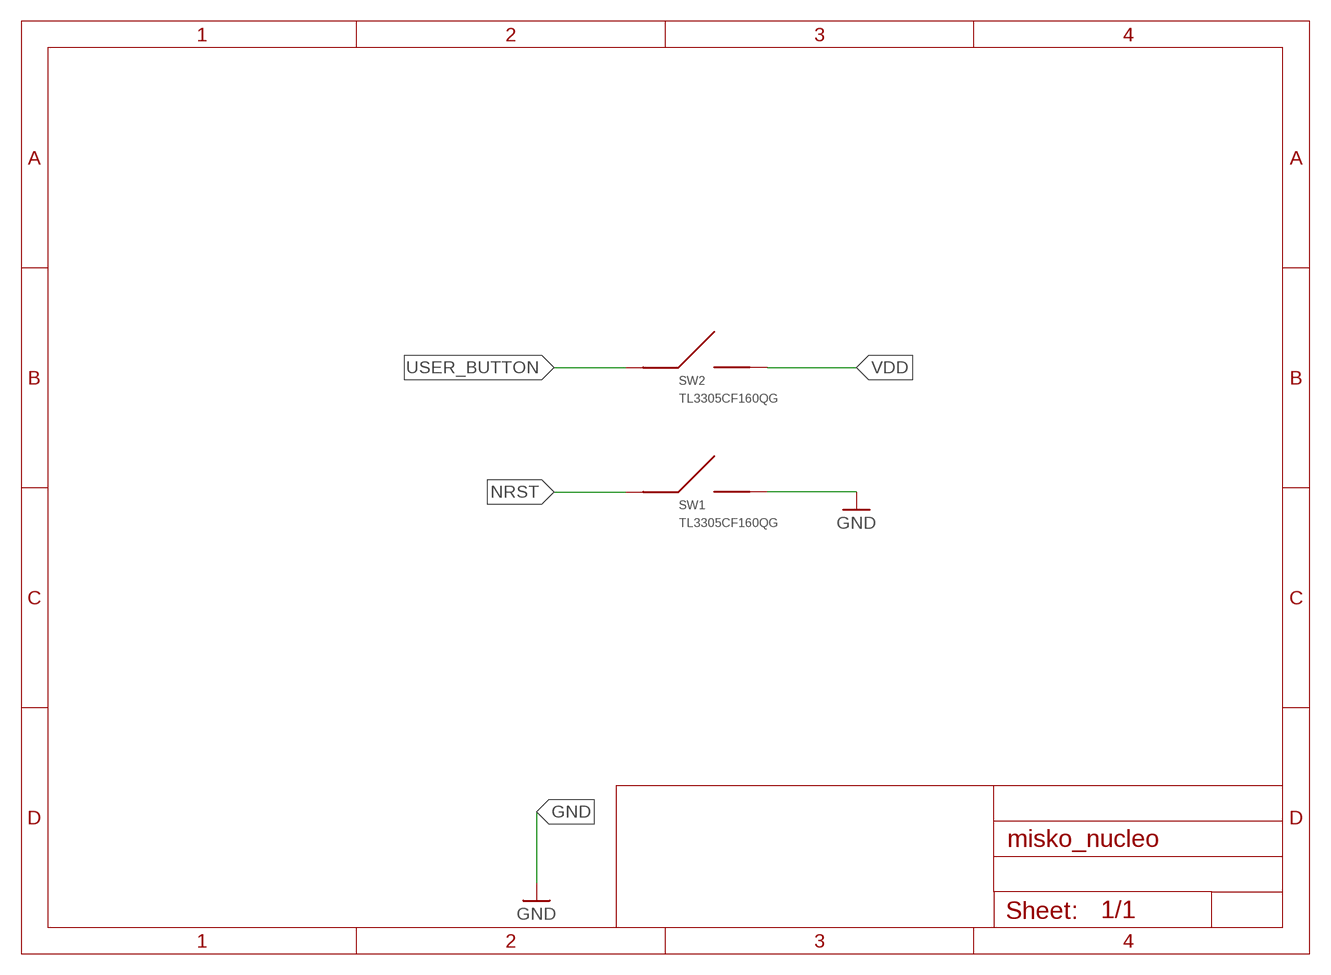
[diagram p10: schematic, module BUTTONS, sheet 1]

### Parts
SW1  TL3305CF160QG  TL3305-844809  [SMD]
SW2  TL3305CF160QG  TL3305-844809  [SMD]

### Nets
GND: SW1.3 SW1.4
NRST [signal]: SW1.1 SW1.2
USER_BUTTON [signal]: SW2.1 SW2.2
VDD [3V3]: SW2.3 SW2.4

### Library data of the parts
SW1 SW2 = TL3305-844809 SPST-NO Tact Switch:TL3305-844809

## Net classes
0 GND: width 0.25 mm, drill 0.35 mm, clearance 0.1 mm
1 3V3: width 0.25 mm, drill 0.35 mm, clearance 0.1 mm to class 0, clearance 0.1 mm
2 signal: width 0.25 mm, drill 0.35 mm, clearance 0.1 mm to class 0, clearance 0.1 mm to class 1, clearance 0.1 mm

## Board
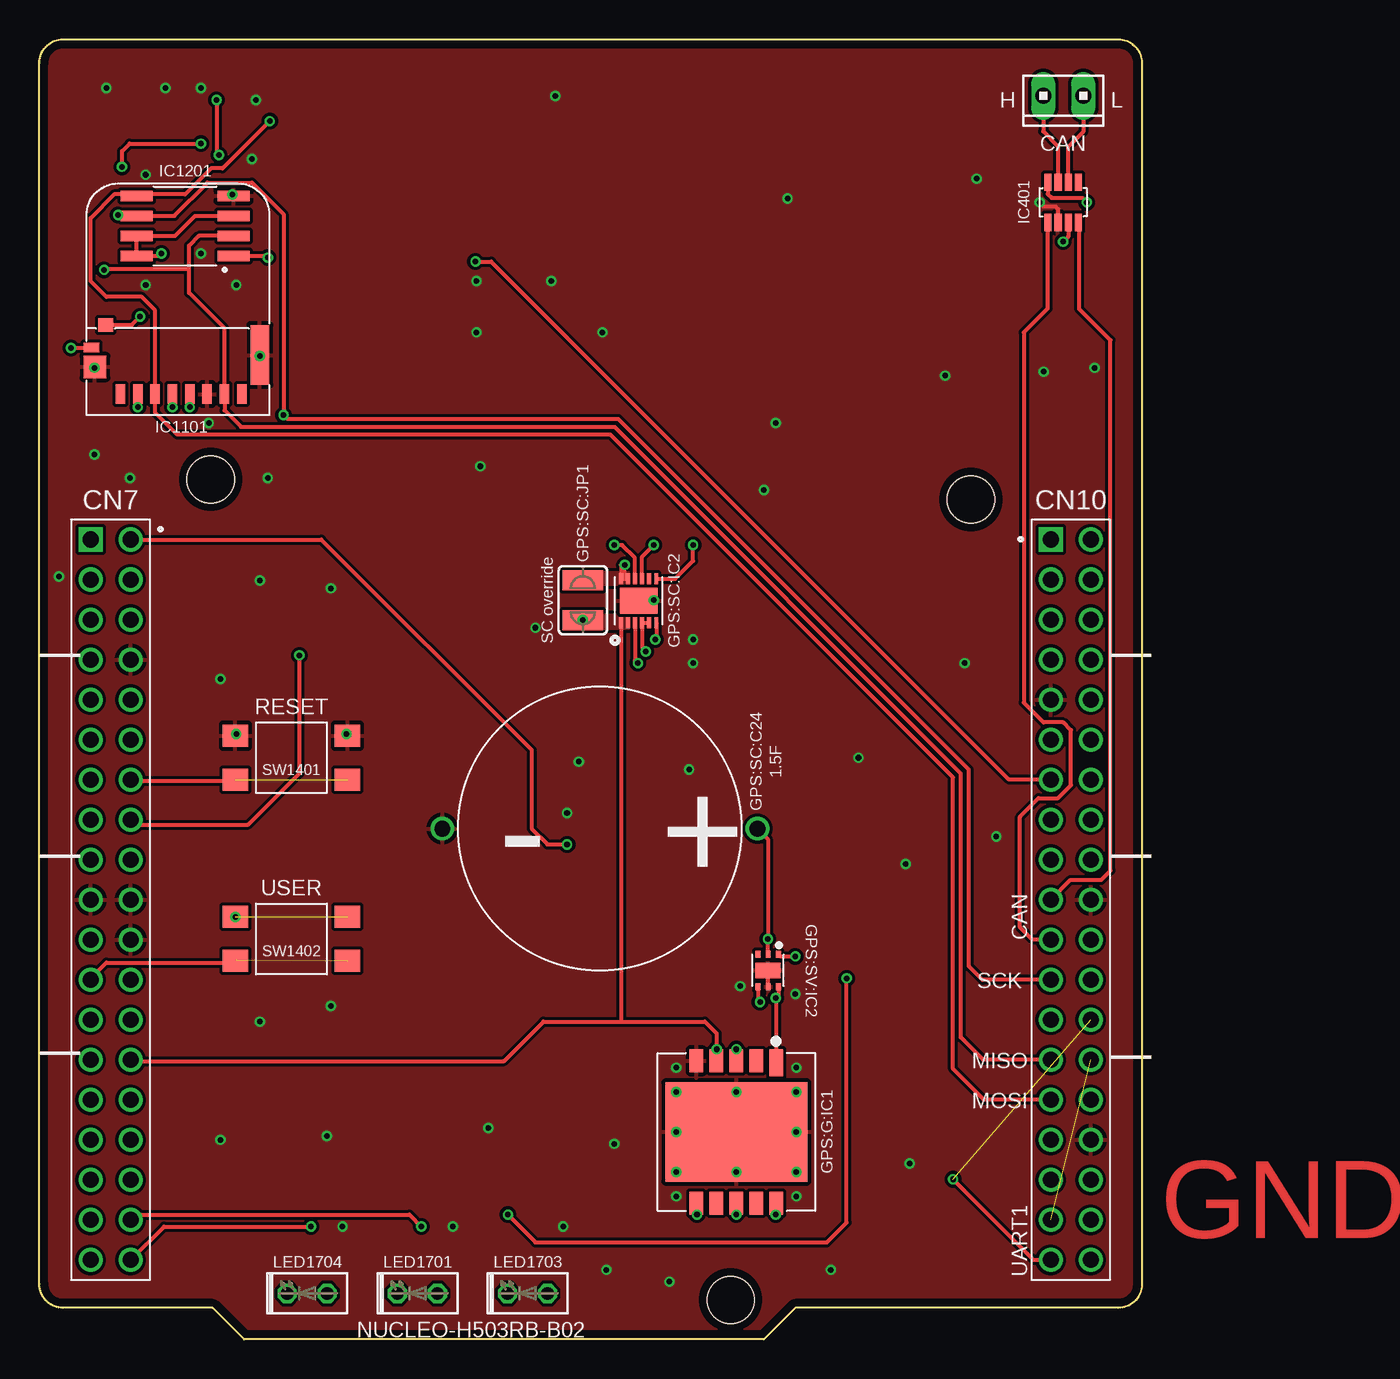
[diagram p11: board, top side]
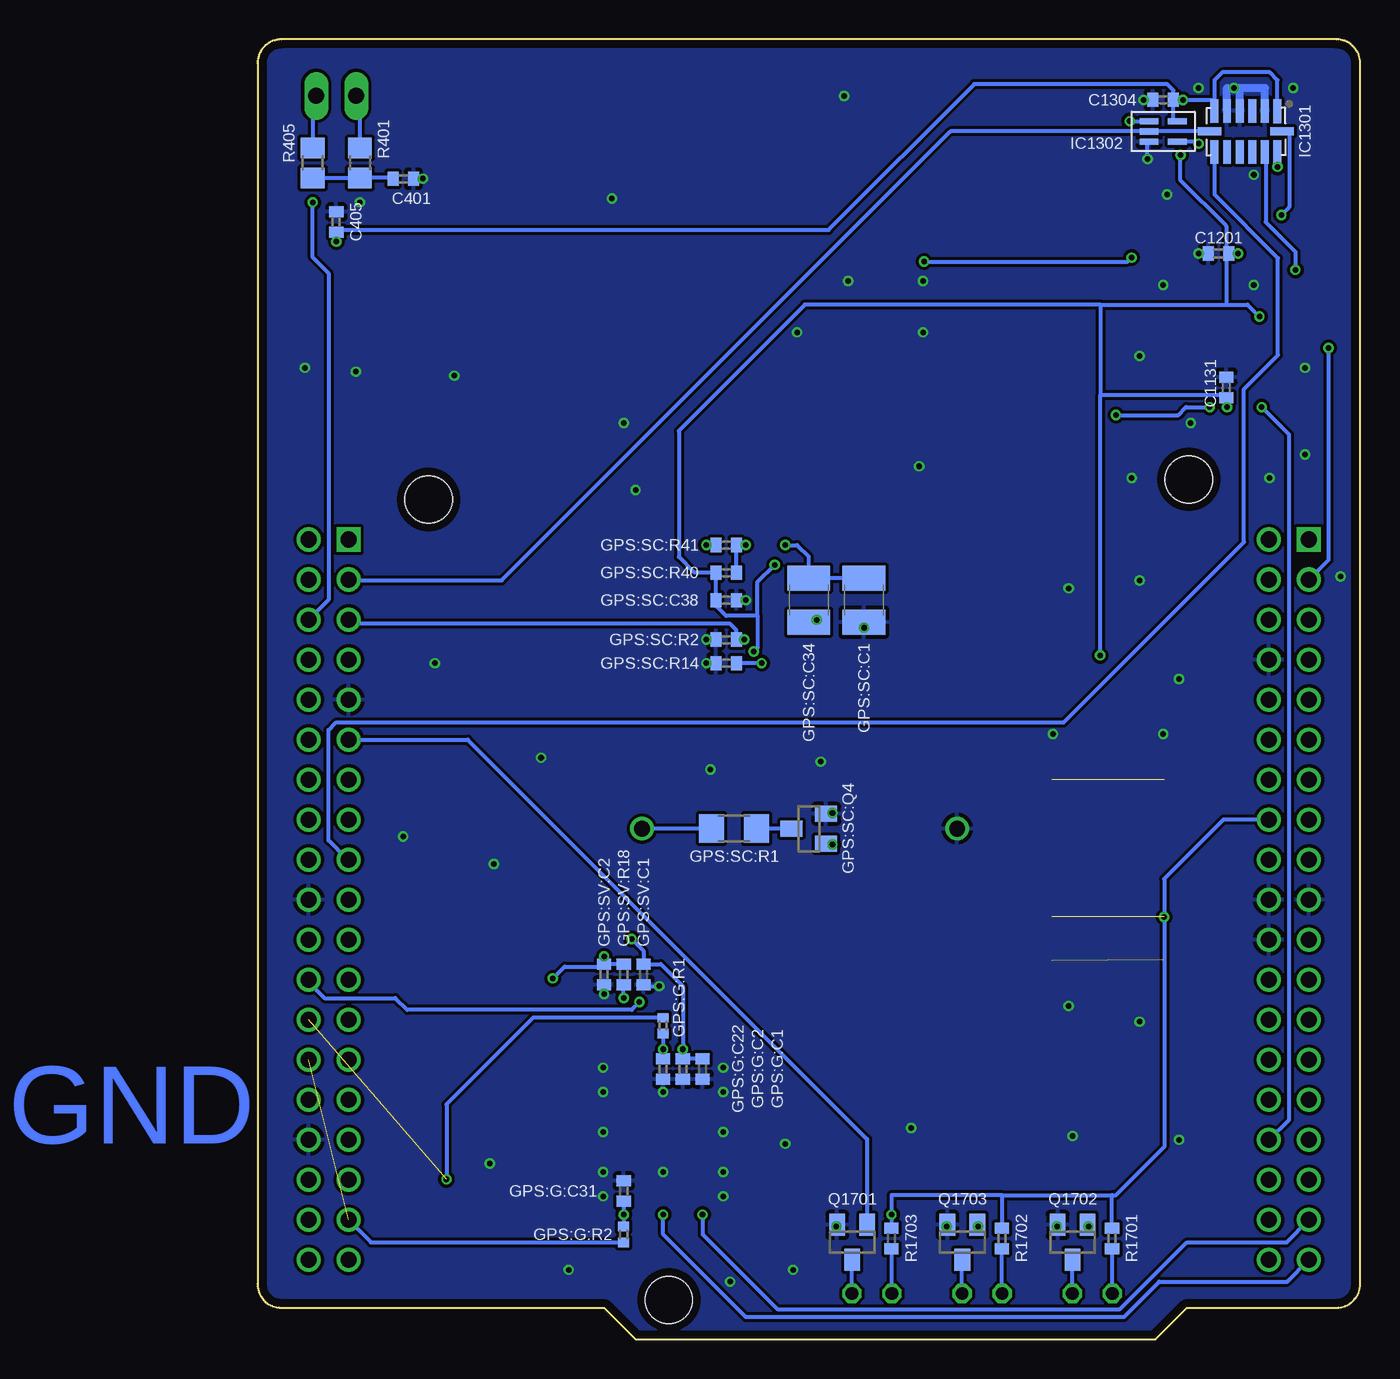
[diagram p12: board, bottom side, seen from below]

Size 70 x 82.5 mm. Coordinates in mm from the lower left corner, seen from the top.
Copper layers (1*16): Top 0.035mm / dielectric 1.5mm / Bottom 0.035mm
Design rules "markovac_2layer": minimum track width 0.2mm, minimum drill 0.35mm, track to track 0.2mm, track to pad 0.2mm, pad to pad 0.2mm, via to via 0.2mm, smd to smd 0.2mm, copper to edge 0.5mm, drill to drill 8mil, minimum pad ring 0.15mm, minimum via ring 0.15mm, stop-mask expansion 4mil, vias tented up to drill 0.35mm, thermal gap 10mil

### Footprints (pad centres in the part's own frame; a part is rotated, then mirrored left to right if it is on the bottom)
NUCLEO-H503RB-B02 = drill 1.02 square: CN7_1 -31.75,9.51; CN10_1 29.21,9.51 | drill 1.02: CN7_2 -29.21,9.51; CN7_3 -31.75,6.97; CN7_4 -29.21,6.97; CN7_5 -31.75,4.43; CN7_6 -29.21,4.43; CN7_7 -31.75,1.89; CN7_8 -29.21,1.89; CN7_9 -31.75,-0.65; CN7_10 -29.21,-0.65; CN7_11 -31.75,-3.19; CN7_12 -29.21,-3.19; CN7_13 -31.75,-5.73; CN7_14 -29.21,-5.73; CN7_15 -31.75,-8.27; CN7_16 -29.21,-8.27; CN7_17 -31.75,-10.81; CN7_18 -29.21,-10.81; CN7_19 -31.75,-13.35; CN7_20 -29.21,-13.35; CN7_21 -31.75,-15.89; CN7_22 -29.21,-15.89; CN7_23 -31.75,-18.43; CN7_24 -29.21,-18.43; CN7_25 -31.75,-20.97; CN7_26 -29.21,-20.97; CN7_27 -31.75,-23.51; CN7_28 -29.21,-23.51; CN7_29 -31.75,-26.05; CN7_30 -29.21,-26.05; CN7_31 -31.75,-28.59; CN7_32 -29.21,-28.59; CN7_33 -31.75,-31.13; CN7_34 -29.21,-31.13; CN7_35 -31.75,-33.67; CN7_36 -29.21,-33.67; CN7_37 -31.75,-36.21; CN7_38 -29.21,-36.21; CN10_2 31.75,9.51; CN10_3 29.21,6.97; CN10_4 31.75,6.97; CN10_5 29.21,4.43; CN10_6 31.75,4.43; CN10_7 29.21,1.89; CN10_8 31.75,1.89; CN10_9 29.21,-0.65; CN10_10 31.75,-0.65; CN10_11 29.21,-3.19; CN10_12 31.75,-3.19; CN10_13 29.21,-5.73; CN10_14 31.75,-5.73; CN10_15 29.21,-8.27; CN10_16 31.75,-8.27; CN10_17 29.21,-10.81; CN10_18 31.75,-10.81; CN10_19 29.21,-13.35; CN10_20 31.75,-13.35; CN10_21 29.21,-15.89; CN10_22 31.75,-15.89; CN10_23 29.21,-18.43; CN10_24 31.75,-18.43; CN10_25 29.21,-20.97; CN10_26 31.75,-20.97; CN10_27 29.21,-23.51; CN10_28 31.75,-23.51; CN10_29 29.21,-26.05; CN10_30 31.75,-26.05; CN10_31 29.21,-28.59; CN10_32 31.75,-28.59; CN10_33 29.21,-31.13; CN10_34 31.75,-31.13; CN10_35 29.21,-33.67; CN10_36 31.75,-33.67; CN10_37 29.21,-36.21; CN10_38 31.75,-36.21 | hole 3: 8.89,-38.75; 24.13,12.05; -24.13,13.32
C0402 = smd 0.7 x 0.9: 1 -0.65,0; 2 0.65,0
SMD = smd 1.7 x 0.86: 1_ON_OFF -4.393,2.54 | smd 1.45 x 0.86: 2_1PPS -4.518,1.27; 3_TX -4.518,0; 4_VCC -4.518,-1.27; 5_GND -4.518,-2.54; !RESET!_8 4.518,0; CTS_7 4.518,-1.27; RTS_9 4.518,1.27; RX_10 4.518,2.54; WAKEUP_6 4.518,-2.54 | drill 0.35: GND1 2.54,3.81; GND4 0,-3.81; GND5 -2.54,3.81; GND6 2.54,-3.81; GND7 -2.54,-3.81; GND8 0,3.81; GND9 2.54,0; GND10 -2.54,0; GND12 4.08,-3.81; GND13 -4.08,-3.81; GND14 4.08,3.81; GND15 -4.08,3.81 | smd 6.3 x 9: GND2 0,0
R0402 = smd 0.6 x 0.7: 1 -0.5,0; 2 0.5,0
C1210 = smd 1.6 x 2.7: 1 -1.4,0; 2 1.4,0
TH = drill 1: + 9.84,0; - -10.16,0
DFN-12 = smd 0.7 x 0.25: !PFO! 1.4,-0.675; EN -1.4,-1.125; FB -1.4,-0.675; PFI 1.4,-0.225; PFI_RET 1.4,-1.125; PROG -1.4,0.225; SEL -1.4,-0.225; VIN1 1.4,0.675; VIN2 1.4,1.125; VMID 1.4,0.225; VOUT1 -1.4,1.125; VOUT2 -1.4,0.675 | smd 1.65 x 2.38: GND 0,0
SJW = smd 1.27 x 2.54: 1 -1.27,0; 2 1.27,0
SOT23 = smd 1 x 1.4: 1 -0.95,-1.1; 2 0.95,-1.1; 3 0,1.1
R1206 = smd 1.6 x 1.803: 1 -1.422,0; 2 1.422,0
R0402' = smd 0.7 x 0.9: 1 -0.65,0; 2 0.65,0
WSON-6 = smd 0.45 x 0.3: !MR! 1.025,-0.625; !RESET! 1.025,0.675; CT -1.025,-0.625; GND1 1.025,0.025; SENSE -1.025,0.025; VDD -1.025,0.675 | smd 1 x 1.6: GND2 0,0
SOT23-8 = smd 0.45 x 1.1: P$1 -0.975,-1.275; P$2 -0.325,-1.275; P$3 0.325,-1.275; P$4 0.975,-1.275; P$5 0.975,1.275; P$6 0.325,1.275; P$7 -0.325,1.275; P$8 -0.975,1.275
MICRO_SD_CONNECTOR = smd 0.6 x 1.25: CD/DAT3 2.75,-1.33; CLK -0.55,-1.33; CMD 1.65,-1.33; DAT0 -2.75,-1.33; DAT1 -3.85,-1.33; DAT2 3.85,-1.33; GND3 -1.65,-1.33; VDD 0.55,-1.33 | smd 0.95 x 0.85: DET 4.775,-5.723 | smd 1.2 x 3.79: GND1 -5,-3.81 | smd 1.45 x 1.4: GND2 5.475,-3.05 | smd 1 x 0.6: POL 5.7,-4.3
SOIC08 = smd 0.66 x 2.032: !CS! -1.905,-3.073; !HOLD! -0.635,3.073; !WP! 0.635,-3.073; GND 1.905,-3.073; SCK 0.635,3.073; SI 1.905,3.073; SO -0.635,-3.073; VCC -1.905,3.073
LGA14 = smd 0.5 x 1.5: !CS! 0,-2.3; SCL 0,2.3 | smd 1.5 x 0.5: GND1 -1.3,-1.2; GND2 -1.3,-0.4; GND3 -1.3,1.2; INT1 1.3,-2; INT2 1.3,-1.2; NC 1.3,-0.4; RESERVED1 1.3,0.4; RESERVED2 -1.3,0.4; SDA 1.3,2; SDO 1.3,1.2; VCC -1.3,-2; VDD -1.276,1.995
SOT353/5 = smd 0.4 x 1.2: A 0,-0.9; B -0.65,-0.9; GND 0.65,-0.9; VCC -0.65,0.9; Y 0.65,0.9
10X02MTA = drill 1.016 long: 1 1.27,0; 2 -1.27,0
LED2X5 = drill 0.813 octagon: A -1.27,0; K 1.27,0
R0805 = smd 1.3 x 1.5: 1 -0.95,0; 2 0.95,0
SMD' = smd 1.6 x 1.4: 1 -3.556,-1.397; 2 3.556,-1.397; 3 -3.556,1.397; 4 3.556,1.397

### Placement (x,y rotation side)
BRD1  35,41.25 0 top
C401  47nF / 10V  [C0402]  60.75,73.66 0 bottom
C405  0.1u / 16V  [C0402]  65,70.91 90 bottom
C1131  0.1u / 16V  [C0402]  8.5,60.41 90 bottom
C1201  0.1u / 16V  [C0402]  9,68.91 180 bottom
C1304  0.1u / 16V  [C0402]  12.5,78.66 180 bottom
GPS:G:C1  0.1u / 16V  [C0402]  41.75,17.16 270 bottom
GPS:G:C2  1u / 16V  [C0402]  43,17.16 270 bottom
GPS:G:C22  33p / 16V  [C0402]  44.25,17.16 270 bottom
GPS:G:C31  33p / 16V  [C0402]  46.75,9.41 90 bottom
GPS:G:IC1  ORG1510-MK4  [SMD]  44.25,13.16 270 top
GPS:G:R1  33R  [R0402]  44.25,19.91 270 bottom
GPS:G:R2  33R  [R0402]  46.75,6.66 90 bottom
GPS:SC:C1  100u / 16V  [C1210]  31.5,46.91 270 bottom
GPS:SC:C24  1.5F  [TH]  35.75,32.41 0 top
GPS:SC:C34  100u / 16V  [C1210]  35,46.91 90 bottom
GPS:SC:C38  0.1u / 16V  [C0402]  40.25,46.91 0 bottom
GPS:SC:IC2  LTC4425EDD#PBF  [DFN-12]  38.04,46.87 90 top
GPS:SC:JP1  SC override  [SJW]  34.5,46.91 90 top
GPS:SC:Q4  SQ2310ES-T1_BE3  [SOT23]  35,32.41 90 bottom
GPS:SC:R1  33R  [R1206]  39.75,32.41 180 bottom
GPS:SC:R2  10k  [R0402']  40.25,44.41 0 bottom
GPS:SC:R14  10k  [R0402']  40.25,42.91 0 bottom
GPS:SC:R40  150k  [R0402']  40.25,48.66 180 bottom
GPS:SC:R41  150k  [R0402']  40.25,50.41 0 bottom
GPS:SV:C1  0.1u / 16V  [C0402]  45.5,23.16 270 bottom
GPS:SV:C2  0.1u / 16V  [C0402]  48,23.16 270 bottom
GPS:SV:IC2  TPS3808G33DBVT  [WSON-6]  46.25,23.41 270 top
GPS:SV:R18  100k  [R0402']  46.75,23.16 90 bottom
IC401  TCAN334  [SOT23-8]  65,72.16 0 top
IC1101  47309-2651  [MICRO_SD_CONNECTOR]  9,58.66 180 top
IC1201  FM25W256  [SOIC08]  9.25,70.66 90 top
IC1301  ADXL345  [LGA14]  7.25,76.66 270 bottom
IC1302  74HCT1G32GW  [SOT353/5]  12.5,76.66 270 bottom
J1  65,78.91 180 top
LED1701  WP710A10SEC  [LED2X5]  24,2.91 180 top
LED1703  WP710A10LZGCK  [LED2X5]  31,2.91 180 top
LED1704  WP710A10SECK/J3  [LED2X5]  17,2.91 180 top
Q1701  SQ2310ES-T1_BE3  [SOT23]  32.25,6.16 180 bottom
Q1702  SQ2310ES-T1_BE3  [SOT23]  18.25,6.16 180 bottom
Q1703  SQ2310ES-T1_BE3  [SOT23]  25.25,6.16 180 bottom
R401  60  [R0805]  63.5,74.66 90 bottom
R405  60  [R0805]  66.5,74.66 270 bottom
R1701  55R  [R0402']  15.75,6.41 90 bottom
R1702  65R  [R0402']  22.75,6.41 90 bottom
R1703  33R  [R0402']  29.75,6.41 90 bottom
SW1401  TL3305CF160QG  [SMD']  16,36.91 0 top
SW1402  TL3305CF160QG  [SMD']  16,25.41 0 top

### Tracks (layer width: path | path; a pad name or v marks a point on that pad's centre or on a via)
3V3  (via drill 0.35)  (1 unrouted)
  Top 0.25: v16.5,43.41 16.5,35.91 13.25,32.66 6.11,32.66 BRD1.CN7_16 | v11.25,78.66 11.25,75.31 v11.4,75.16 | IC1101.VDD v8.45,59.16 | GPS:SC:IC2.FB GPS:SC:IC2.SEL 38.27,43.89 v38.5,43.66 | IC1201.!WP! 9.88,71.3 8.62,70.02 IC1201.!HOLD! IC1201.VCC 7.59,68.75 v7.75,68.91 | GPS:SV:IC2.VDD 47.05,24.31 v48,24.31 | IC1101.DET 5.87,64.38 v6.4,64.91 | GPS:SC:IC2.VIN2 36.91,49.16 v37.16,49.16 37.16,48.27 GPS:SC:IC2.VIN1 | IC401.P$3 65.33,69.98 v65,69.66 | v29.75,7.91 31.5,6.16 50,6.16 51.25,7.41 v51.25,22.91
  Bottom 0.25: R1701.2 15.75,9.16 | 22.75,9.16 15.75,9.16 | 15.75,9.16 15.5,9.16 12.44,12.22 SW1402.3 12.44,29.22 8.68,32.98 BRD1.CN7_16 | 22.75,9.16 R1702.2 | 22.75,9.16 29.75,9.16 v29.75,7.91 R1703.2 | 16.5,65.66 16.5,59.91 | 38.25,45.91 38.25,43.91 v38.5,43.66 | 38.25,45.91 40.25,45.91 40.9,46.56 GPS:SC:C38.1 GPS:SC:R40.2 42.25,48.66 43.25,49.66 43.25,57.66 35.25,65.66 16.5,65.66 | v16.5,43.41 16.5,59.91 | 38.25,45.91 38.25,48.07 v37.16,49.16 | GPS:SV:R18.2 GPS:SV:C2.1 | v48,24.31 GPS:SV:C2.1 | IC1302.VCC 11.85,77.31 C1304.1 | C1304.1 v11.25,78.66 9.25,78.66 IC1301.VCC 9.25,79.91 8.75,80.41 5.75,80.41 5.25,79.91 IC1301.VDD | v6.4,64.91 7.15,65.66 8.5,65.66 | 16.5,59.91 8.5,59.91 C1131.1 8.45,59.71 v8.45,59.16 | 16.5,65.66 8.5,65.66 | v7.75,68.91 C1201.1 8.5,68.91 | 8.5,68.91 8.5,65.66 | 8.5,68.91 8.5,70.66 11.4,73.56 v11.4,75.16 | v65,69.66 C405.1 65,70.31 64.9,70.41 33.75,70.41 24.5,79.66 12.25,79.66 11.85,79.26 C1304.1 | v51.25,22.91 50.5,23.66 48,23.66 GPS:SV:C2.1
  other vias: 12.44,26.81
  pour Top (rank 3, no thermals): 37.5,48.66 37.5,47.91 35,47.91 35,48.66
ADC_VGPS  (via drill 0.35)
  Top 0.25: GPS:G:IC1.4_VCC 42.98,18.39 v43,18.41 43,19.41 42.25,20.16 36.91,20.16 | GPS:SV:IC2.SENSE 46.25,24.46 v46.25,25.41 46.25,31.75 GPS:SC:C24.+ | 36.91,20.16 32,20.16 29.49,17.65 5.88,17.65 BRD1.CN7_28 | GPS:SC:IC2.VOUT1 36.91,20.16
  Bottom 0.25: GPS:G:C1.1 GPS:G:C2.1 v43,18.41 43,22.41 44.4,23.81 GPS:SV:C1.1 45.5,24.66 v46.25,25.41 | GPS:SC:R1.2 GPS:SC:C24.+ | GPS:SC:C34.1 35,45.66 v34.5,45.66
  pour Top (rank 3, no thermals): 37.5,45.91 34.5,45.91 34.5,45.16 37.5,45.16
ADXL345:ADXL345SDA  (via drill 0.35)
  Top 0.25: v5.25,74.41 5.25,75.41 5.72,75.88 v10.25,75.88
  Bottom 0.25: IC1301.SDA v5.25,74.41 | v10.25,75.88 10.38,76.01 IC1302.Y
ADXL345_CS
  Bottom 0.25: IC1301.!CS! IC1302.A 26,76.66 54.5,48.16 64.15,48.16 BRD1.CN10_3
ADXL345_INT1
  Bottom 0.25: IC1301.INT1 9.25,72.66 5.21,68.62 5.21,62.46 7.38,60.3 7.38,50.6 18.81,39.16 65,39.16 65.5,38.66 65.5,31.66 64.28,30.44 BRD1.CN10_17
CAN_!STBY!  (via drill 0.35)
  Top 0.25: IC401.P$8 64.03,72.69 64.28,72.44 66.22,72.44 v66.5,72.16
  Bottom 0.25: v66.5,72.16 66.5,68.66 65.5,67.66 65.5,46.93 BRD1.CN10_6
CAN_H
  Top 0.25: J1.1 63.73,76.66 64.67,75.72 IC401.P$7
  Bottom 0.25: J1.1 63.5,78.68 R401.2
CAN_INFRA:SPLIT
  Bottom 0.25: R405.2 R401.1 61.45,73.71 C401.1
CAN_L
  Top 0.25: IC401.P$6 65.33,75.69 65.77,76.14 66.03,76.4 66.27,76.63 J1.2
  Bottom 0.25: J1.2 66.5,78.68 R405.1
CAN_RX
  Top 0.25: IC401.P$4 66,70.86 66,65.41 68,63.41 68,29.75 67.41,29.16 65.47,29.16 BRD1.CN10_19
CAN_TX
  Top 0.25: IC401.P$1 64,70.86 64,65.41 62.5,63.91 62.5,40.41 63.75,39.16 65,39.16 65.5,38.66 65.5,35.18 64.66,34.34 63.43,34.34 62.25,33.16 62.25,26.16 63.05,25.36 BRD1.CN10_21
GND  (via drill 0.35)
  Top 0.25: GPS:SV:IC2.GND1 46.25,22.41 GPS:SV:IC2.GND2 | v63.5,72.16 63.75,71.91 64.5,71.91 64.67,71.73 IC401.P$2
  Bottom 0.25: v13.5,74.91 13.5,75.91 IC1302.GND | v44.5,22.41 45.5,22.41 GPS:SV:C1.2 | v8,79.41 7.75,79.41 7.65,79.31
  Bottom 0.508: IC1301.GND2 7.65,79.31 | IC1301.GND1 8.45,79.41 v8,79.41 6.05,79.41 IC1301.GND3
  other vias: 19.25,7.16 26.25,7.16 33.25,7.16 59.5,73.66 3.5,61.66 14,62.41 10.25,68.91 13.75,78.66 33.5,33.41 31.5,45.16 41.5,42.91 41.5,44.41 39,46.91 48,21.91 4.25,79.41 10.25,79.41 27.75,67.16 32.5,67.16 27.75,63.91 35.75,63.91 28,55.41 14.5,54.66 14,48.16 18.5,47.66 11.5,41.91 5.75,54.66 3.5,56.16 1.25,48.41 12.5,66.91 32.75,78.91 57.5,61.16 63.75,61.41 67,61.66 58.75,42.91 34.25,36.66 41.25,36.16 36.5,12.41 28.5,13.41 12.5,38.41 19.5,38.41 11.5,12.66 18.25,12.91 14,20.16 18.5,21.16 36,4.41 40,3.66 50.25,4.41 55.25,11.16 6.75,66.91 6.75,73.91 12.25,72.66 10.75,58.16 46,53.91 46.75,58.16 47.5,72.41 52,36.91 55,30.16 60.75,31.91
  pour Top (rank 4): -1,83.91 71,83.91 71,-1.09 -1,-1.09
  pour Bottom (rank 6): -1,83.91 71,83.91 71,-1.09 -1,-1.09
GPS:G:GPS_RX  (via drill 0.35)
  Top 0.25: GPS:G:IC1.RX_10 46.79,7.95 v46.75,7.91
  Bottom 0.25: GPS:G:R2.2 v46.75,7.91 GPS:G:C31.1
GPS:G:GPS_TX  (via drill 0.35)
  Top 0.25: v44.25,18.41 GPS:G:IC1.3_TX
  Bottom 0.25: GPS:G:R1.2 v44.25,18.41 GPS:G:C22.1
GPS:GPS_ON_OFF  (via drill 0.35)
  Top 0.25: GPS:SV:IC2.!RESET! 46.92,21.83 v46.75,21.66 46.75,17.59 GPS:G:IC1.1_ON_OFF
  Bottom 0.25: v46.75,21.66 GPS:SV:R18.1
GPS:SC:PFI  (via drill 0.35)
  Top 0.25: GPS:SC:IC2.PFI 38.27,49.67 v39,50.41
  Bottom 0.25: GPS:SC:R40.1 GPS:SC:R41.2 v39,50.41
GPS:SC:PFI_RET  (via drill 0.35)
  Top 0.25: GPS:SC:IC2.PFI_RET 40.36,48.27 41.5,49.41 v41.5,50.41
  Bottom 0.25: v41.5,50.41 GPS:SC:R41.1
GPS:SC:PROG  (via drill 0.35)
  Top 0.25: GPS:SC:IC2.PROG 37.81,43.09 v38,42.91
  Bottom 0.25: v38,42.91 GPS:SC:R14.2
GPS:SC:SC_DIS_DRAIN
  Bottom 0.25: GPS:SC:Q4.3 GPS:SC:R1.1
GPS:SC:VMID  (via drill 0.35)
  Top 0.25: v36.5,50.41 37,50.41 37.81,49.59 GPS:SC:IC2.VMID
  Bottom 0.25: GPS:SC:C1.1 GPS:SC:C34.2 35,49.66 35.75,50.41 v36.5,50.41
GPS_!RESET!  (via drill 0.35)
  Top 0.25: GPS:G:IC1.!RESET!_8 v44.25,7.91
  Bottom 0.25: v44.25,7.91 44.25,6.66 39,1.41 15,1.41 12.75,3.66 4.63,3.66 BRD1.CN7_37
GPS_MCU_RX  (1 unrouted)
  Bottom 0.25: BRD1.CN10_35 62.79,6.16 GPS:G:R2.1
GPS_MCU_TX  (via drill 0.35)  (1 unrouted)
  Top 0.25: v58,10.16 63.12,5.04 BRD1.CN10_37
  Bottom 0.25: GPS:G:R1.1 52.5,20.41 58,14.91 v58,10.16
GPS_PWR_CTRL  (via drill 0.35)
  Top 0.25: GPS:SV:IC2.!MR! 45.62,21.53 v45.75,21.41
  Bottom 0.25: v45.75,21.41 46.25,20.91 60.5,20.91 61.25,21.66 65.75,21.66 66.75,22.66 BRD1.CN10_24
GPS_WKUP  (via drill 0.35)
  Top 0.25: GPS:G:IC1.WAKEUP_6 41.75,8.6 v41.75,7.91
  Bottom 0.25: v41.75,7.91 41.75,6.66 37,1.91 15.25,1.91 11,6.16 4.67,6.16 BRD1.CN7_35
LED:G_A
  Bottom 0.25: Q1701.3 32.27,5.04 LED1703.A
LED:G_C
  Bottom 0.25: R1703.1 29.73,5.74 LED1703.K
LED:R_A
  Bottom 0.25: Q1702.3 18.27,5.04 LED1704.A
LED:R_C
  Bottom 0.25: R1701.1 15.73,5.74 LED1704.K
LED:Y_A
  Bottom 0.25: Q1703.3 25.27,5.04 LED1701.A
LED:Y_C
  Bottom 0.25: R1702.1 22.73,5.74 LED1701.K
LED_GREEN
  Bottom 0.25: Q1701.1 31.3,12.71 56.65,38.06 BRD1.CN10_11
LED_RED  (via drill 0.35)
  Top 0.25: BRD1.CN7_38 7.91,7.16 v17.25,7.16
  Bottom 0.25: Q1702.1 17.3,7.21 v17.25,7.16
LED_YELLOW  (via drill 0.35)
  Top 0.25: v24.25,7.16 23.5,7.91 6.12,7.91 BRD1.CN7_36
  Bottom 0.25: Q1703.1 24.3,7.21 v24.25,7.16
NRST  (1 unrouted)
  Top 0.25: BRD1.CN7_14 5.9,35.41 12.34,35.41 SW1401.1
SD_CD  (via drill 0.35)
  Top 0.25: IC1101.POL 3.25,62.91 v2,62.91
  Bottom 0.25: BRD1.CN7_3 2,49.47 v2,62.91
SPI1_FRAM_CS  (via drill 0.35)
  Top 0.25: v14.51,68.65 v14.5,68.65 14.39,68.75 IC1201.!CS! | v27.69,68.4 28.69,68.4 61.56,35.52 BRD1.CN10_13
  Bottom 0.25: v27.69,68.4 14.76,68.4 v14.51,68.65
SPI1_MISO  (via drill 0.35)
  Top 0.25: 9.5,67.91 4.15,67.91 v4.11,67.87 | 9.5,67.91 9.5,66.41 11.75,64.16 IC1101.DAT0 11.75,58.95 12.79,57.91 36.5,57.91 58.5,35.91 58.5,19.16 59.92,17.74 BRD1.CN10_27 | IC1201.SO 10.12,70.02 9.5,69.41 9.5,67.91
  Bottom 0.25: IC1301.SDO 6,75.31 6,70.91 4.11,69.02 v4.11,67.87
SPI1_MOSI  (via drill 0.35)
  Top 0.25: v14.62,77.31 11.62,74.31 10.9,74.31 9.25,72.66 6.25,72.66 6.18,72.59 IC1201.SI 6.08,72.66 4.75,72.66 3.25,71.16 3.25,67.16 4.25,66.16 6.5,66.16 7.35,65.31 IC1101.CMD 7.35,58.81 8.75,57.41 36.25,57.41 58,35.66 58,17.16 59.96,15.2 BRD1.CN10_29
  Bottom 0.25: v14.62,77.31 IC1302.B
SPI1_SCK  (via drill 0.35)
  Top 0.25: v5,71.36 5,71.3 IC1201.SCK 8.56,71.3 10.68,73.41 13.5,73.41 15.5,71.41 v15.5,58.66 15.75,58.41 36.75,58.41 59,36.16 59,23.69 59.87,22.82 BRD1.CN10_23 | IC1101.CLK v9.55,59.16
  Bottom 0.25: IC1301.SCL 4.5,76.66 4.5,71.86 v5,71.36 | v15.5,58.66 11.55,58.66 11.05,59.16 v9.55,59.16
SPI1_SD_CS  (via drill 0.35)
  Top 0.25: IC1101.CD/DAT3 v6.25,59.16
  Bottom 0.25: v6.25,59.16 4.5,57.41 4.5,13.95 BRD1.CN7_32
SUPERCAP_!EN!  (via drill 0.35)
  Top 0.25: GPS:SC:IC2.EN 39.16,44.47 v39.1,44.41
  Bottom 0.25: v39.1,44.41 GPS:SC:R2.2 39.6,45.01 40,45.41 63.94,45.41 BRD1.CN10_5
SUPERCAP_DISCHARGE  (via drill 0.35)
  Top 0.25: v33.5,31.41 32.25,31.41 31.25,32.41 31.25,37.41 17.9,50.76 BRD1.CN7_2
  Bottom 0.25: GPS:SC:Q4.1 33.85,31.41 v33.5,31.41
USER_BUTTON  (1 unrouted)
  Top 0.25: 12.4,24.01 SW1402.1 | 12.4,24.01 12.3,23.91 4.25,23.91 3.25,22.91 BRD1.CN7_23 | 12.4,24.01 12.49,24.1

### Text on the board
Top: GND
Bottom: GND
tPlace: H | L | CAN | SC override | RESET | USER | CAN | SCK | MISO | MOSI | UART1
tNames: | | | | | | | | | | |
tStop: misko POC / ejovrh rev.3
Document: can rx | lp uart1 tx | can tx | lp uart1 rx | can tx | sck | miso | mosi | can tx | uart2 tx | can rx | uart2 rx | can tx | mosi | lptim2 in1 | uart2 tx | sck | uart2 rx | lptim1 in2 | docu | lptim2 in1 | miso | lptim1 in2 | can tx | miso | lptim1 in1 | lptim1 in1 | uart2 rx | can rx | mosi | can tx | sck | lp uart1 rx | lptim1 in2 | uart2 tx | uart2 tx | lptim1 in1 | lptim2 in2 | lp uart1 rx | miso | lptim2 in1 | can rx | mosi | sck